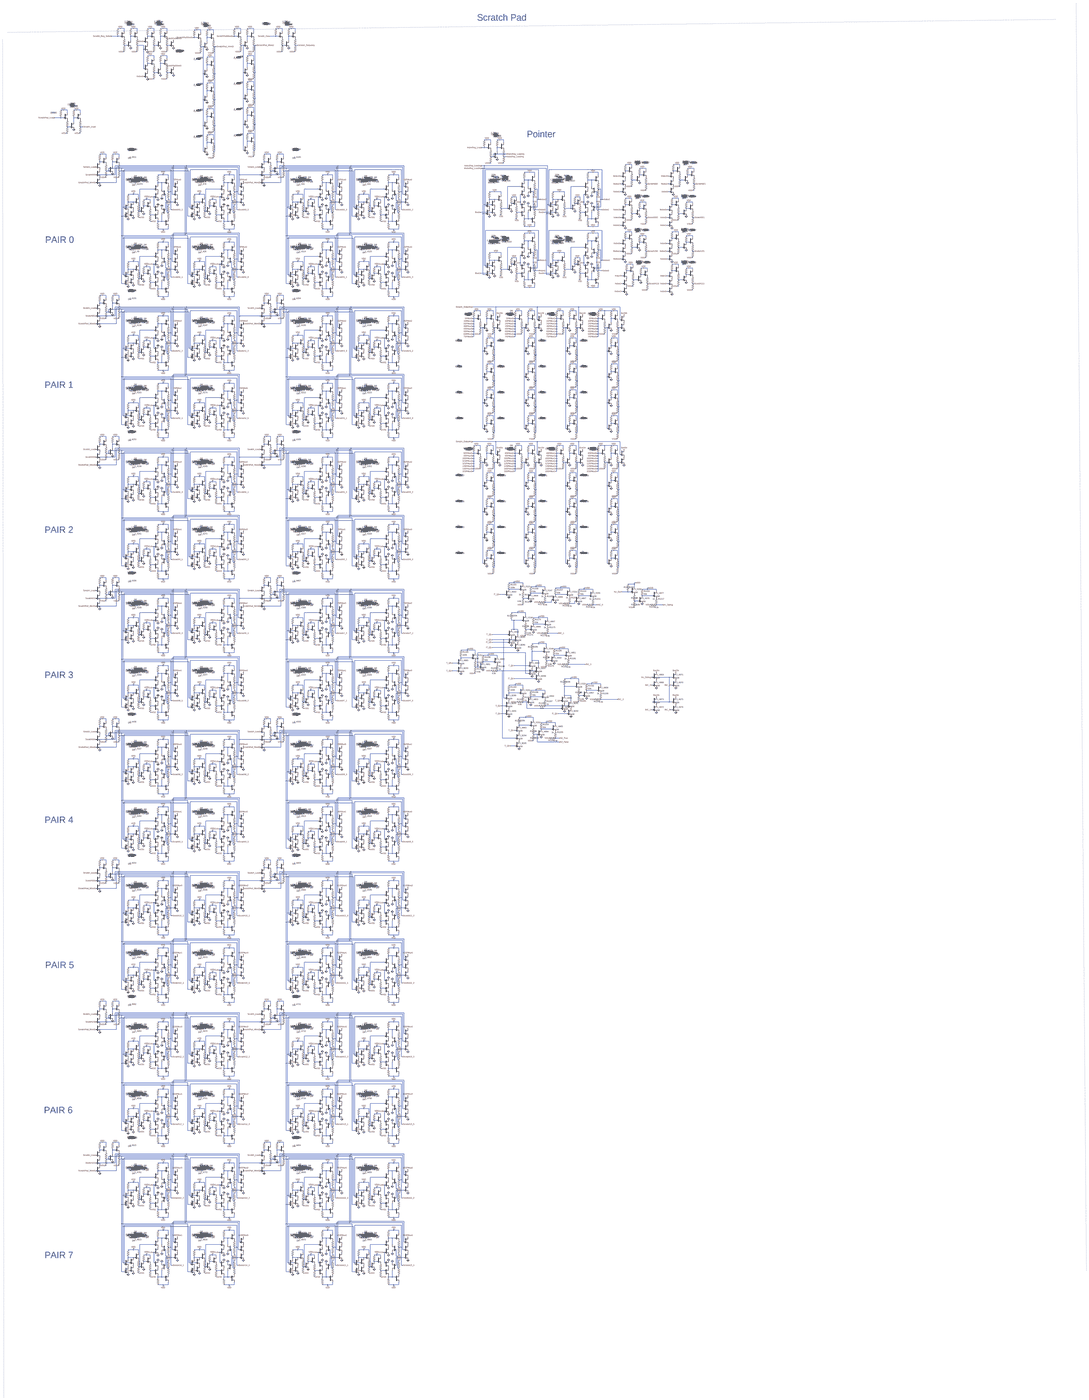
[diagram p0: schematic scratchpad.asc, whole sheet]
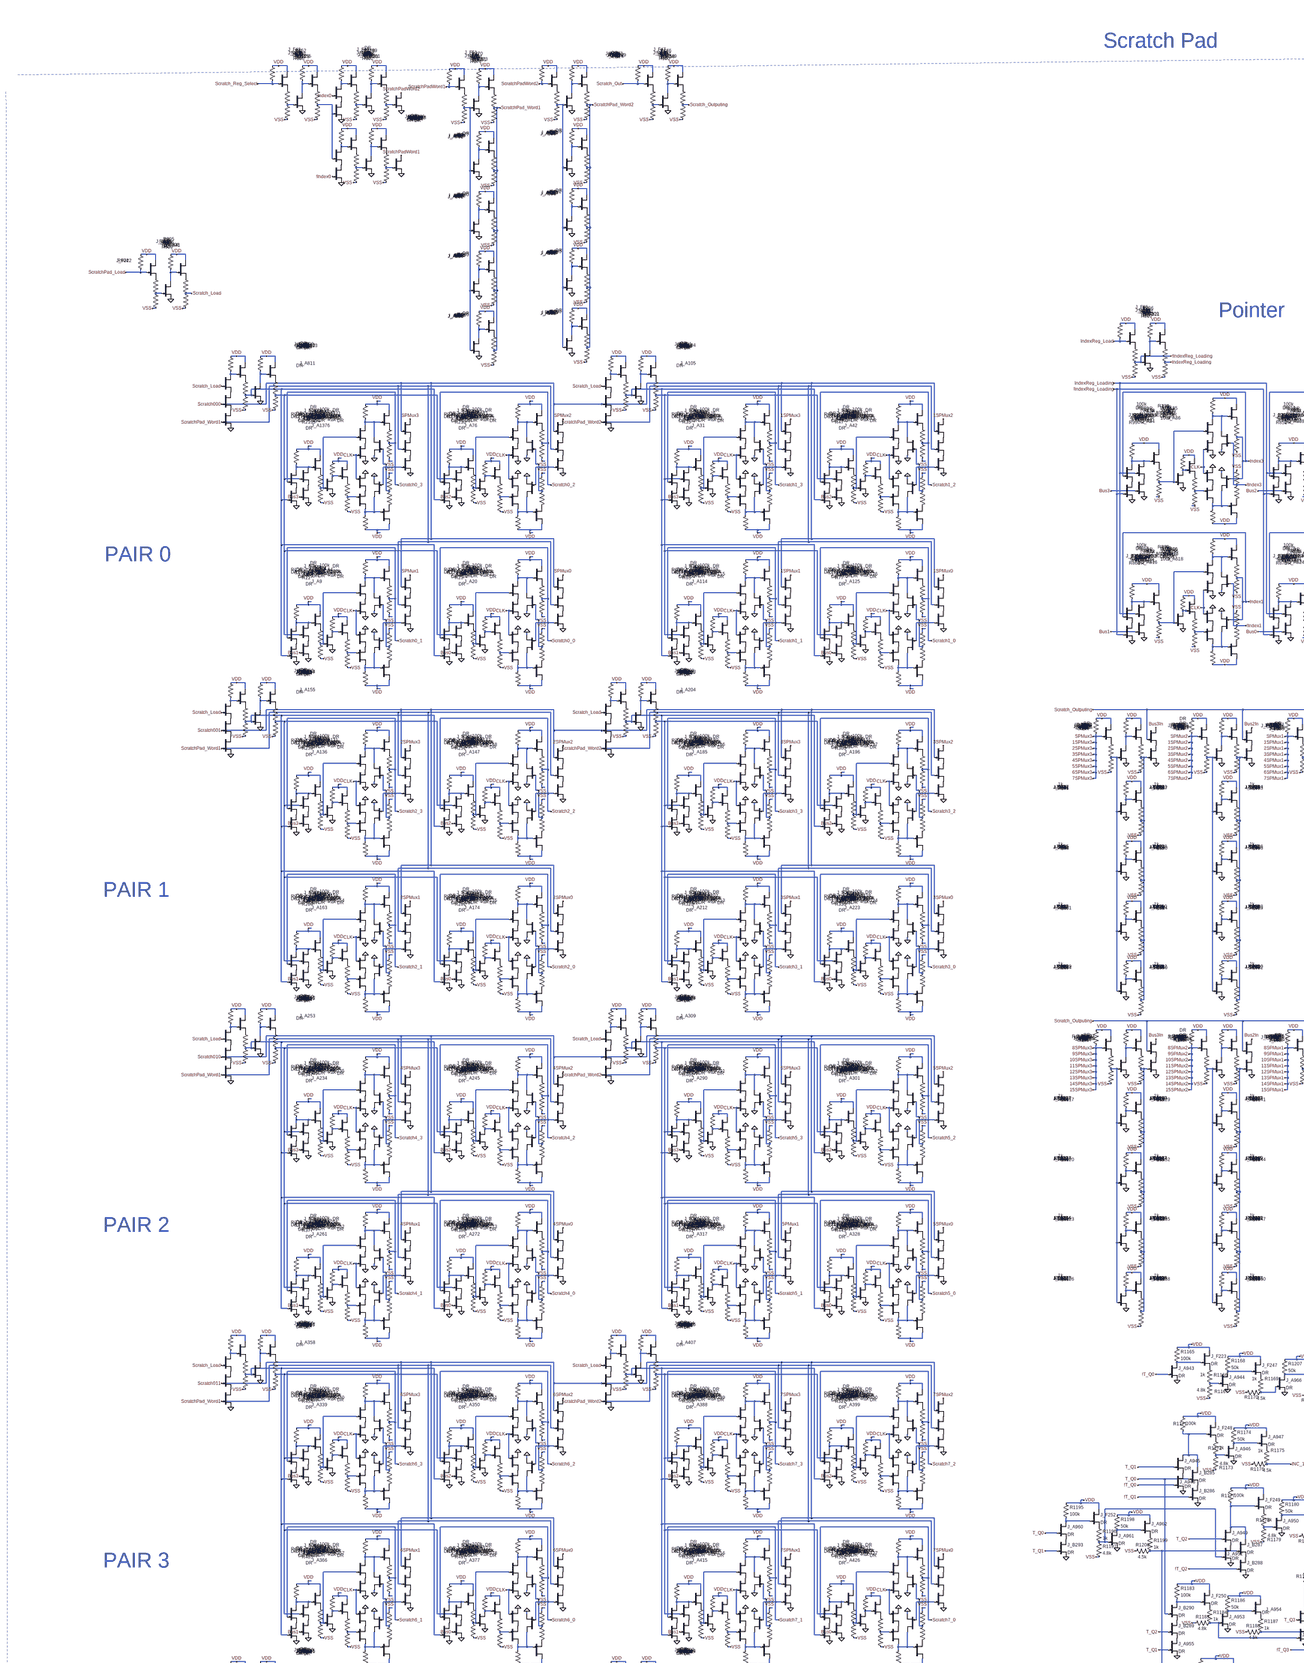
[diagram p1: schematic scratchpad.asc, part, row 1 of 2, column 1 of 2]
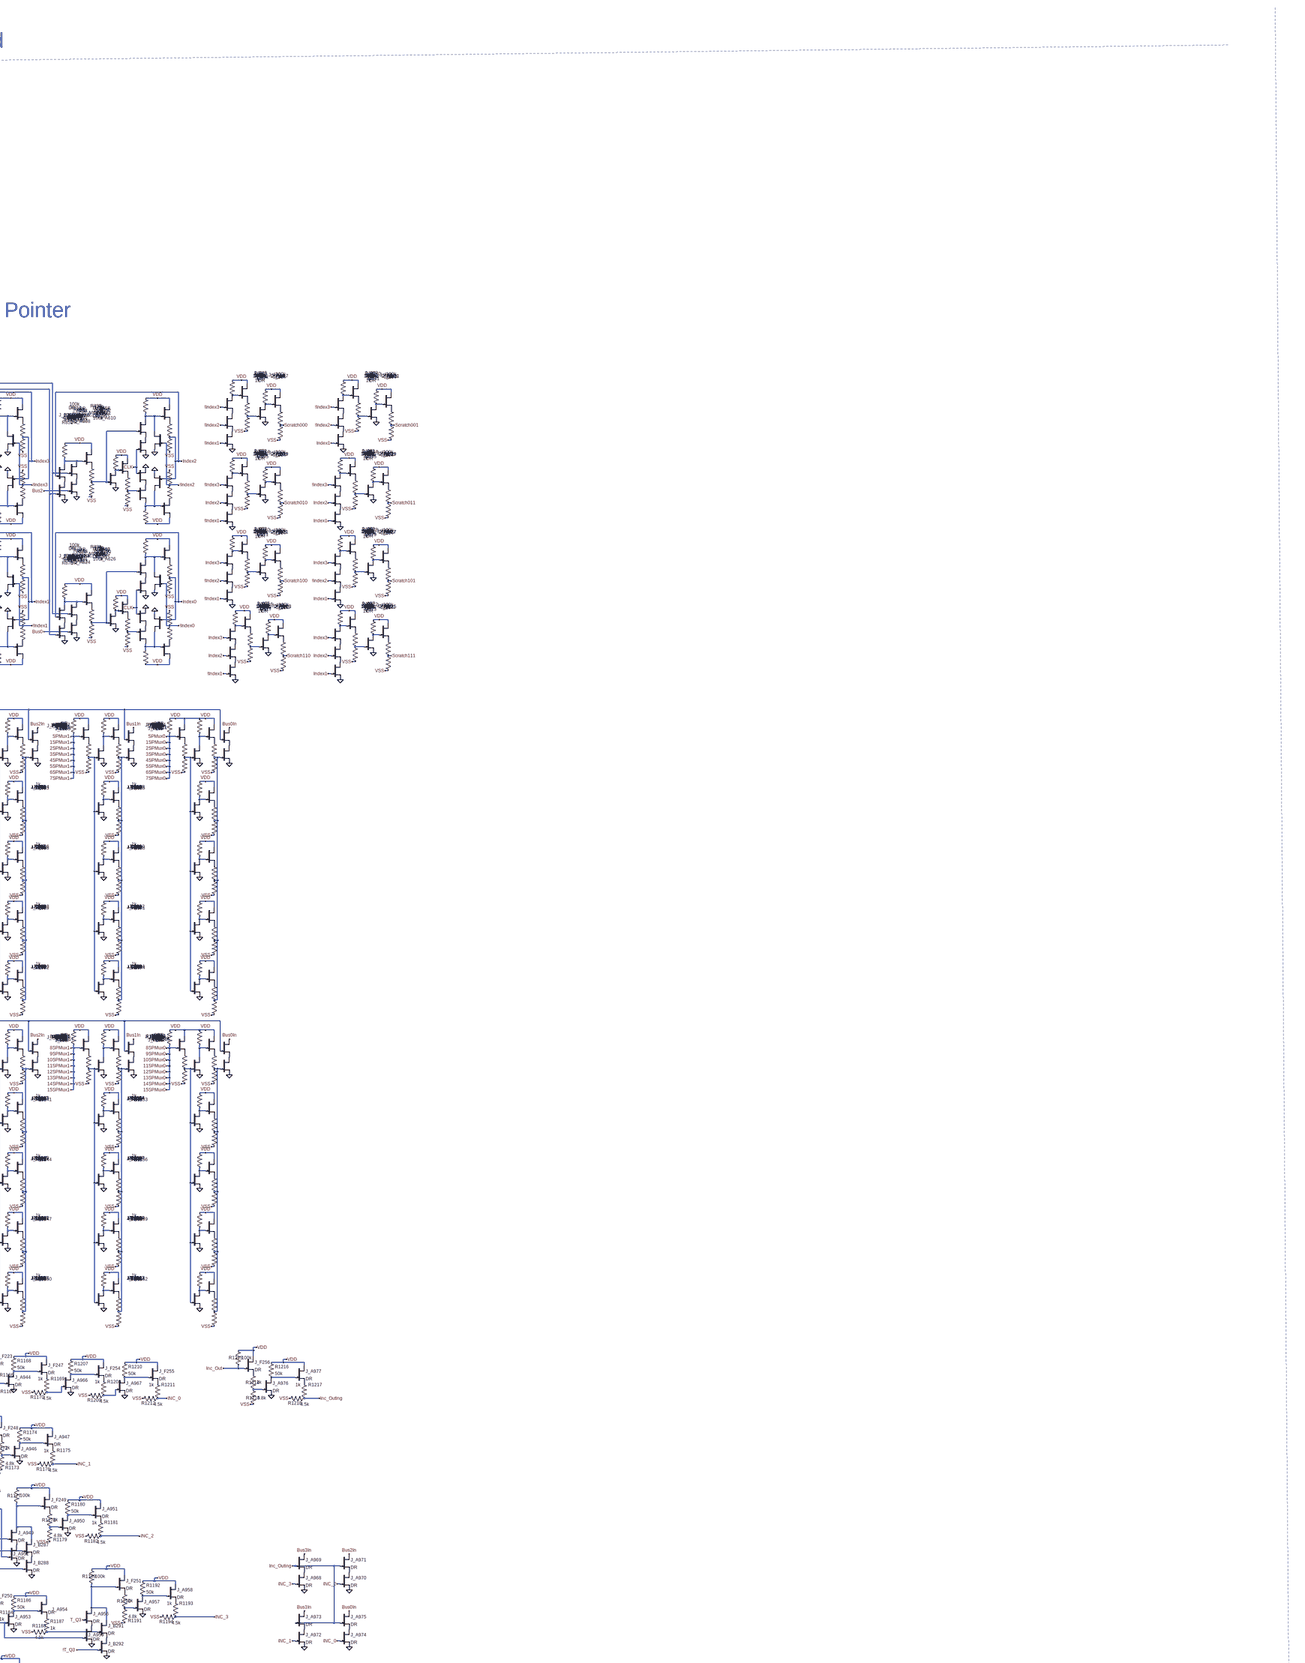
[diagram p2: schematic scratchpad.asc, part, row 1 of 2, column 2 of 2]
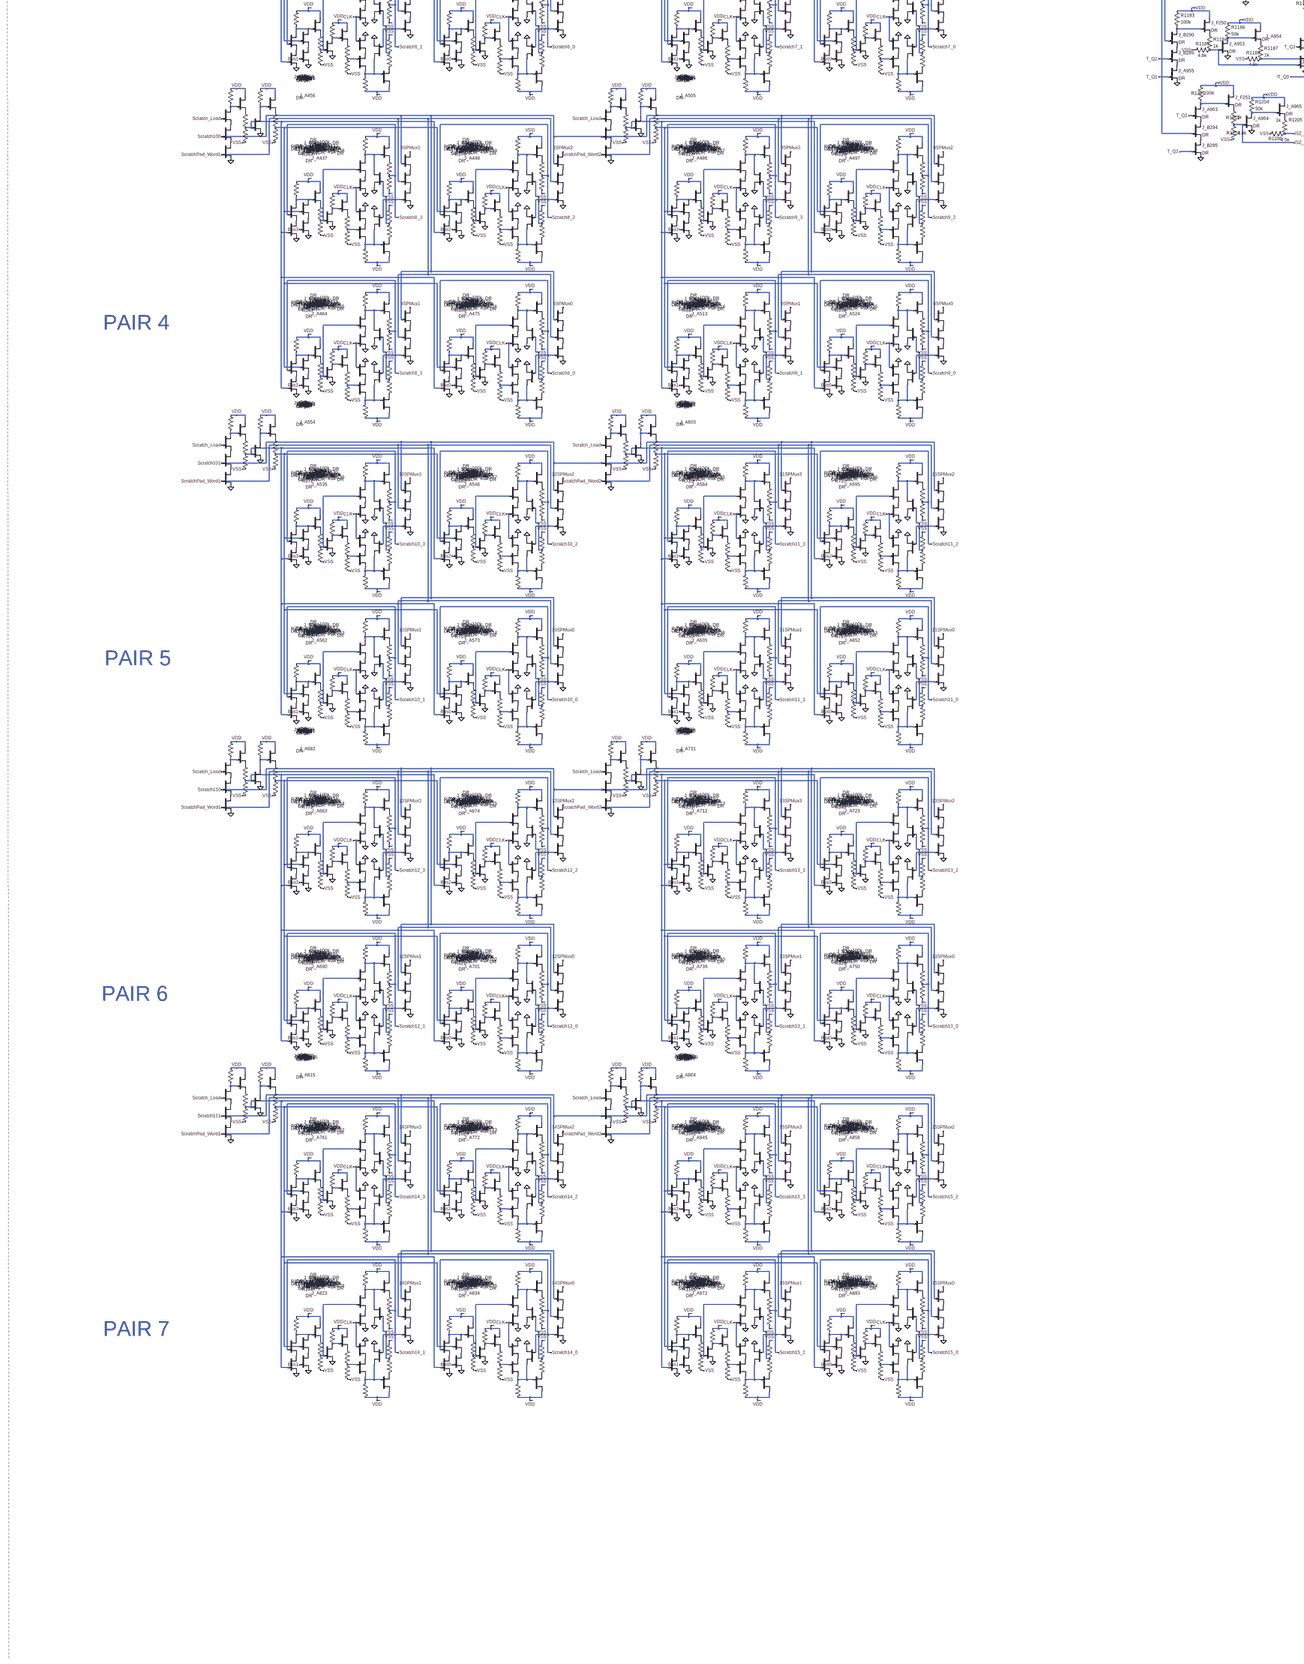
[diagram p3: schematic scratchpad.asc, part, row 2 of 2, column 1 of 2]
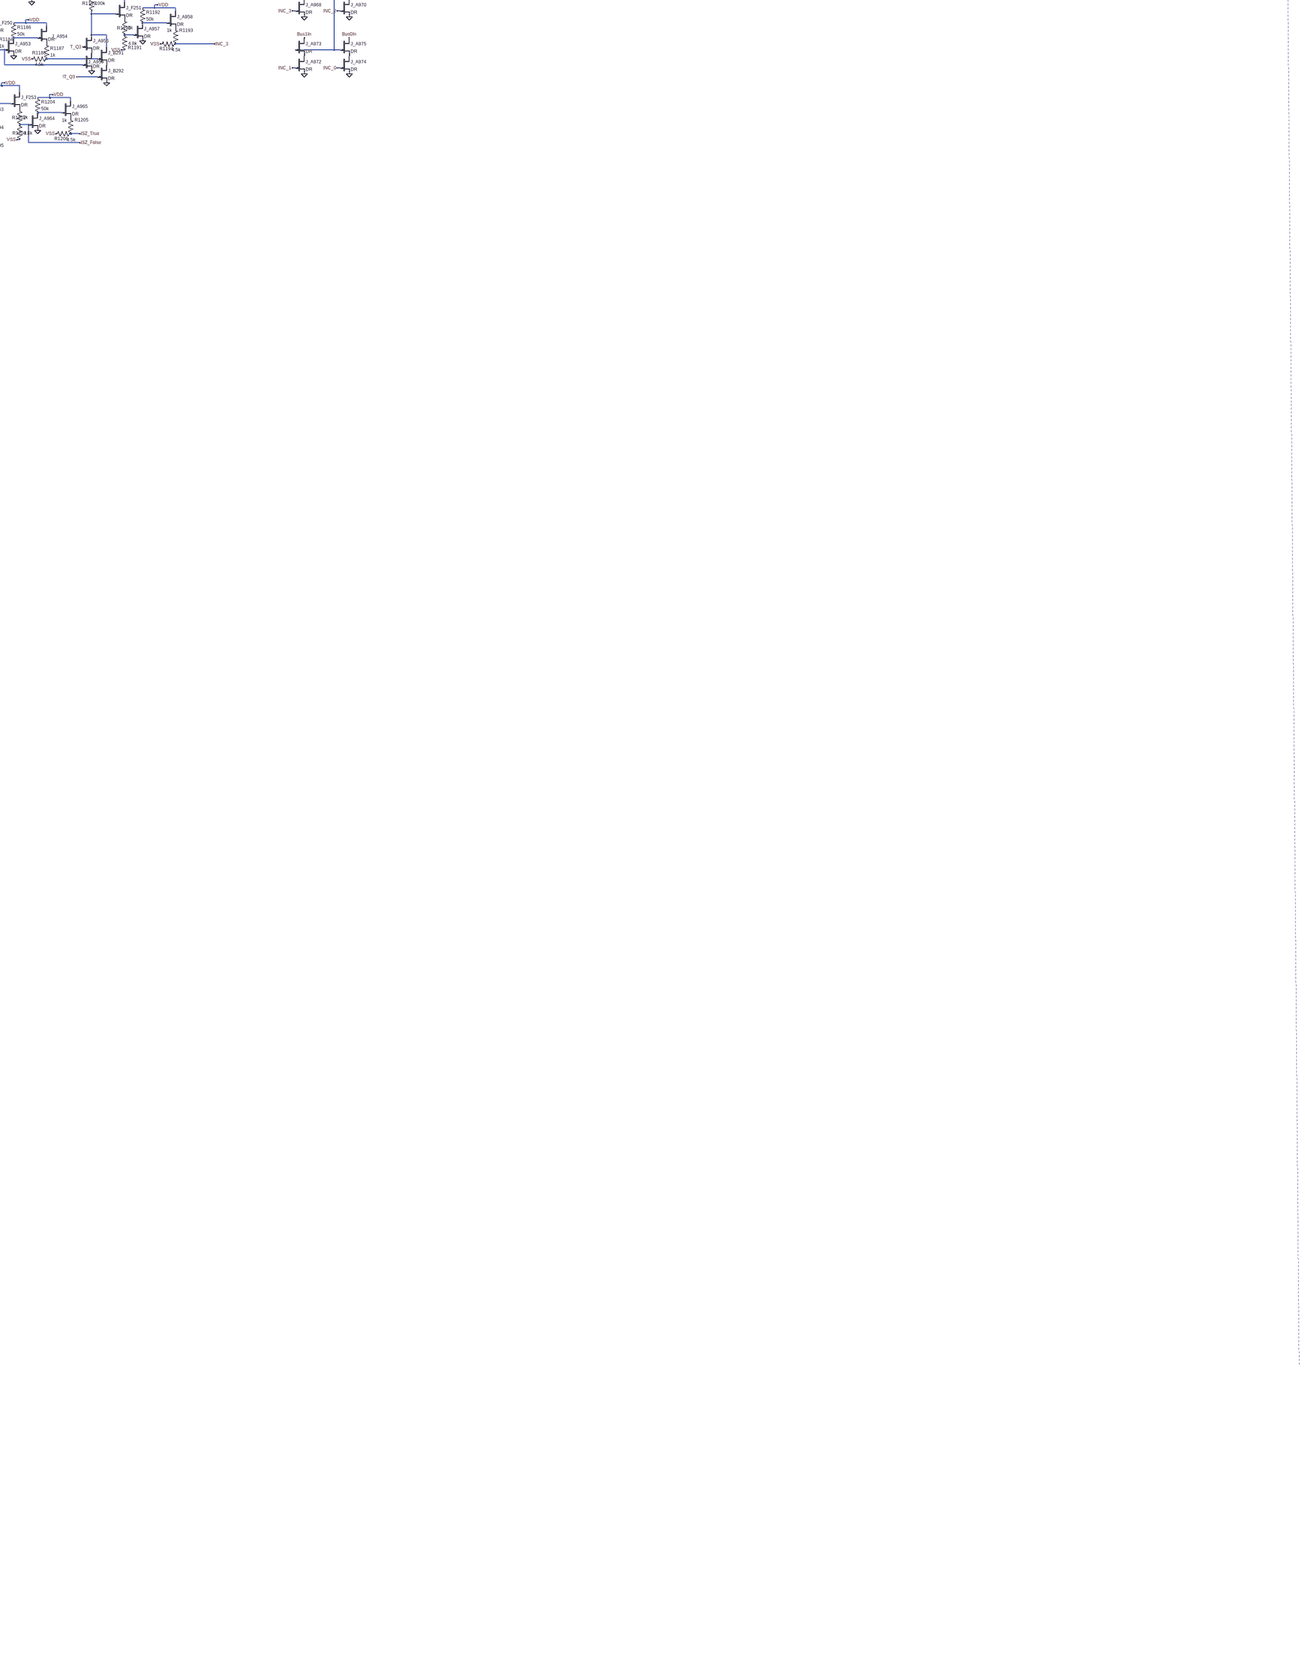
[diagram p4: schematic scratchpad.asc, part, row 2 of 2, column 2 of 2]
* scratchpad.asc
J_A1369 N045 N051 P001 DR
R2125 VDD N045 100k
J_F510 VDD N045 P002 DR
R2126 P002 Scratch0_3 1k
R2127 Scratch0_3 VSS 4.8k
J_B634 N045 N057 0 DR
J_A1370 N085 N079 P003 DR
R2128 VDD N085 100k
J_F511 VDD N085 P004 DR
R2129 P004 N057 1k
R2130 N057 VSS 4.8k
J_B635 N085 Scratch0_3 0 DR
J_A1371 P001 CLK 0 DR
J_A1372 P003 CLK 0 DR
J_A1373 N061 Scratch0_3 P005 DR
R2131 VDD N061 100k
J_F512 VDD N061 P006 DR
R2132 P006 N051 1k
R2133 N051 VSS 4.8k
J_B636 N061 N035 P007 DR
J_A1374 N069 N051 0 DR
R2134 VDD N069 50k
J_A1375 VDD N069 P008 DR
R2135 P008 N079 1k
R2136 N079 VSS 4.5k
J_A1376 P005 N033 0 DR
J_B637 P007 Bus3 0 DR
J_A64 P009 Scratch0_3 0 DR
J_A65 P010 ScratchPad_Word1 P009 DR
J_A66 7SPMux3 Scratch000 P010 DR
J_A1 N046 N052 P011 DR
R223 VDD N046 100k
J_F32 VDD N046 P012 DR
R224 P012 Scratch0_2 1k
R225 Scratch0_2 VSS 4.8k
J_B38 N046 N058 0 DR
J_A70 N086 N080 P013 DR
R226 VDD N086 100k
J_F64 VDD N086 P014 DR
R227 P014 N058 1k
R228 N058 VSS 4.8k
J_B39 N086 Scratch0_2 0 DR
J_A71 P011 CLK 0 DR
J_A72 P013 CLK 0 DR
J_A73 N062 Scratch0_2 P015 DR
R229 VDD N062 100k
J_F65 VDD N062 P016 DR
R230 P016 N052 1k
R231 N052 VSS 4.8k
J_B40 N062 N035 P017 DR
J_A74 N070 N052 0 DR
R232 VDD N070 50k
J_A75 VDD N070 P018 DR
R233 P018 N080 1k
R234 N080 VSS 4.5k
J_A76 P015 N033 0 DR
J_B41 P017 Bus2 0 DR
J_A77 P019 Scratch0_2 0 DR
J_A78 P020 ScratchPad_Word1 P019 DR
J_A286 7SPMux2 Scratch000 P020 DR
J_A48 N041 N049 P021 DR
R97 VDD N041 100k
J_F78 VDD N041 P022 DR
R98 P022 Index3 1k
R99 Index3 VSS 4.8k
J_B32 N041 !Index3 0 DR
J_A49 N083 N075 P023 DR
R100 VDD N083 100k
J_F79 VDD N083 P024 DR
R101 P024 !Index3 1k
R102 !Index3 VSS 4.8k
J_B33 N083 Index3 0 DR
J_A84 P021 CLK 0 DR
J_A85 P023 CLK 0 DR
J_A86 N055 Index3 P025 DR
R193 VDD N055 100k
J_F80 VDD N055 P026 DR
R194 P026 N049 1k
R195 N049 VSS 4.8k
J_B34 N055 IndexReg_Loading P027 DR
J_A87 N065 N049 0 DR
R196 VDD N065 50k
J_A92 VDD N065 P028 DR
R197 P028 N075 1k
R198 N075 VSS 4.5k
J_A93 P025 !IndexReg_Loading 0 DR
J_B35 P027 Bus3 0 DR
J_A606 N042 N050 P029 DR
R850 VDD N042 100k
J_F209 VDD N042 P030 DR
R851 P030 Index2 1k
R852 Index2 VSS 4.8k
J_B249 N042 !Index2 0 DR
J_A607 N084 N076 P031 DR
R853 VDD N084 100k
J_F210 VDD N084 P032 DR
R854 P032 !Index2 1k
R855 !Index2 VSS 4.8k
J_B250 N084 Index2 0 DR
J_A608 P029 CLK 0 DR
J_A609 P031 CLK 0 DR
J_A610 N056 Index2 P033 DR
R856 VDD N056 100k
J_F211 VDD N056 P034 DR
R857 P034 N050 1k
R858 N050 VSS 4.8k
J_B251 N056 IndexReg_Loading P035 DR
J_A611 N066 N050 0 DR
R859 VDD N066 50k
J_A612 VDD N066 P036 DR
R860 P036 N076 1k
R861 N076 VSS 4.5k
J_A613 P033 !IndexReg_Loading 0 DR
J_B252 P035 Bus2 0 DR
J_A614 N091 N095 P037 DR
R862 VDD N091 100k
J_F212 VDD N091 P038 DR
R863 P038 Index1 1k
R864 Index1 VSS 4.8k
J_B253 N091 !Index1 0 DR
J_A615 N129 N125 P039 DR
R865 VDD N129 100k
J_F213 VDD N129 P040 DR
R866 P040 !Index1 1k
R867 !Index1 VSS 4.8k
J_B254 N129 Index1 0 DR
J_A616 P037 CLK 0 DR
J_A617 P039 CLK 0 DR
J_A618 N107 Index1 P041 DR
R868 VDD N107 100k
J_F214 VDD N107 P042 DR
R869 P042 N095 1k
R870 N095 VSS 4.8k
J_B255 N107 IndexReg_Loading P043 DR
J_A619 N109 N095 0 DR
R871 VDD N109 50k
J_A620 VDD N109 P044 DR
R872 P044 N125 1k
R873 N125 VSS 4.5k
J_A621 P041 !IndexReg_Loading 0 DR
J_B256 P043 Bus1 0 DR
J_A622 N092 N096 P045 DR
R874 VDD N092 100k
J_F215 VDD N092 P046 DR
R875 P046 Index0 1k
R876 Index0 VSS 4.8k
J_B257 N092 !Index0 0 DR
J_A623 N130 N126 P047 DR
R877 VDD N130 100k
J_F216 VDD N130 P048 DR
R878 P048 !Index0 1k
R879 !Index0 VSS 4.8k
J_B258 N130 Index0 0 DR
J_A624 P045 CLK 0 DR
J_A625 P047 CLK 0 DR
J_A626 N108 Index0 P049 DR
R880 VDD N108 100k
J_F217 VDD N108 P050 DR
R881 P050 N096 1k
R882 N096 VSS 4.8k
J_B259 N108 IndexReg_Loading P051 DR
J_A627 N110 N096 0 DR
R883 VDD N110 50k
J_A628 VDD N110 P052 DR
R884 P052 N126 1k
R885 N126 VSS 4.5k
J_A629 P049 !IndexReg_Loading 0 DR
J_B260 P051 Bus0 0 DR
R904 VDD ScratchPad_Load 100k
J_F222 VDD ScratchPad_Load P053 DR
R905 P053 N025 1k
R906 N025 VSS 4.8k
J_A640 N024 N025 0 DR
R907 VDD N024 50k
J_A641 VDD N024 P054 DR
R908 P054 Scratch_Load 1k
R909 VSS Scratch_Load 4.5k
J_A44 N037 !Index3 P055 DR
R85 VDD N037 100k
J_F29 VDD N037 P056 DR
R86 P056 N043 1k
R87 N043 VSS 4.8k
J_B16 P055 !Index2 P057 DR
J_A45 N039 N043 0 DR
R88 VDD N039 50k
J_F30 VDD N039 P058 DR
R89 P058 Scratch000 1k
R90 VSS Scratch000 4.5k
J_B17 P057 !Index1 0 DR
J_A50 N067 !Index3 P059 DR
R103 VDD N067 100k
J_F33 VDD N067 P060 DR
R104 P060 N077 1k
R105 N077 VSS 4.8k
J_B18 P059 Index2 P061 DR
J_A51 N073 N077 0 DR
R106 VDD N073 50k
J_F34 VDD N073 P062 DR
R107 P062 Scratch010 1k
R108 VSS Scratch010 4.5k
J_B19 P061 !Index1 0 DR
J_A52 N089 Index3 P063 DR
R109 VDD N089 100k
J_F35 VDD N089 P064 DR
R110 P064 N097 1k
R111 N097 VSS 4.8k
J_B20 P063 !Index2 P065 DR
J_A53 N093 N097 0 DR
R112 VDD N093 50k
J_F36 VDD N093 P066 DR
R113 P066 Scratch100 1k
R114 VSS Scratch100 4.5k
J_B21 P065 !Index1 0 DR
J_A54 N119 Index3 P067 DR
R115 VDD N119 100k
J_F37 VDD N119 P068 DR
R116 P068 N131 1k
R117 N131 VSS 4.8k
J_B22 P067 Index2 P069 DR
J_A55 N127 N131 0 DR
R118 VDD N127 50k
J_F38 VDD N127 P070 DR
R119 P070 Scratch110 1k
R120 VSS Scratch110 4.5k
J_B23 P069 !Index1 0 DR
J_A56 N120 Index3 P071 DR
R121 VDD N120 100k
J_F39 VDD N120 P072 DR
R122 P072 N132 1k
R123 N132 VSS 4.8k
J_B24 P071 Index2 P073 DR
J_A57 N128 N132 0 DR
R124 VDD N128 50k
J_F40 VDD N128 P074 DR
R125 P074 Scratch111 1k
R126 VSS Scratch111 4.5k
J_B25 P073 Index1 0 DR
J_A58 N090 Index3 P075 DR
R127 VDD N090 100k
J_F41 VDD N090 P076 DR
R128 P076 N098 1k
R129 N098 VSS 4.8k
J_B26 P075 !Index2 P077 DR
J_A59 N094 N098 0 DR
R130 VDD N094 50k
J_F42 VDD N094 P078 DR
R131 P078 Scratch101 1k
R132 VSS Scratch101 4.5k
J_B27 P077 Index1 0 DR
J_A60 N068 !Index3 P079 DR
R133 VDD N068 100k
J_F43 VDD N068 P080 DR
R134 P080 N078 1k
R135 N078 VSS 4.8k
J_B28 P079 Index2 P081 DR
J_A61 N074 N078 0 DR
R136 VDD N074 50k
J_F44 VDD N074 P082 DR
R137 P082 Scratch011 1k
R138 VSS Scratch011 4.5k
J_B29 P081 Index1 0 DR
J_A62 N038 !Index3 P083 DR
R139 VDD N038 100k
J_F45 VDD N038 P084 DR
R140 P084 N044 1k
R141 N044 VSS 4.8k
J_B30 P083 !Index2 P085 DR
J_A63 N040 N044 0 DR
R142 VDD N040 50k
J_F46 VDD N040 P086 DR
R143 P086 Scratch001 1k
R144 VSS Scratch001 4.5k
J_B31 P085 Index1 0 DR
R145 VDD Scratch_Out 100k
J_F47 VDD Scratch_Out P087 DR
R146 P087 N012 1k
R147 N012 VSS 4.8k
J_A67 N005 N012 0 DR
R148 VDD N005 50k
J_A68 VDD N005 P088 DR
R149 P088 Scratch_Outputing 1k
R150 VSS Scratch_Outputing 4.5k
R151 VDD Scratch_Reg_Select 100k
J_F48 VDD Scratch_Reg_Select P089 DR
R152 P089 N007 1k
R153 N007 VSS 4.8k
J_A69 N001 N007 0 DR
R154 VDD N001 50k
J_A79 VDD N001 P090 DR
R155 P090 N008 1k
R156 VSS N008 4.5k
R157 VDD N002 100k
J_F49 VDD N002 P091 DR
R158 P091 N009 1k
R159 N009 VSS 4.8k
J_A82 N003 N009 0 DR
R160 VDD N003 50k
J_A83 VDD N003 P092 DR
R161 P092 N010 1k
R162 VSS N010 4.5k
J_A793 N002 Index0 P093 DR
J_A794 P093 N008 0 DR
R163 VDD N014 100k
J_F50 VDD N014 P094 DR
R164 P094 N018 1k
R165 N018 VSS 4.8k
J_A795 N015 N018 0 DR
R166 VDD N015 50k
J_A796 VDD N015 P095 DR
R167 P095 N019 1k
R168 VSS N019 4.5k
J_A797 N014 N008 P096 DR
J_A798 P096 !Index0 0 DR
J_A799 ScratchPadWord2 N010 0 DR
J_A800 ScratchPadWord1 N019 0 DR
R169 VDD ScratchPadWord1 100k
J_F51 VDD ScratchPadWord1 P097 DR
R170 P097 N013 1k
R171 N013 VSS 4.8k
J_A80 N006 N013 0 DR
R172 VDD N006 50k
J_A81 VDD N006 P098 DR
R173 P098 ScratchPad_Word1 1k
R174 VSS ScratchPad_Word1 4.5k
R175 VDD ScratchPadWord2 100k
J_F52 VDD ScratchPadWord2 P099 DR
R176 P099 N011 1k
R177 N011 VSS 4.8k
J_A96 N004 N011 0 DR
R178 VDD N004 50k
J_A97 VDD N004 P100 DR
R179 P100 ScratchPad_Word2 1k
R180 VSS ScratchPad_Word2 4.5k
R205 VDD IndexReg_Load 100k
J_F86 VDD IndexReg_Load P101 DR
R206 P101 !IndexReg_Loading 1k
R207 !IndexReg_Loading VSS 4.8k
J_A102 N028 !IndexReg_Loading 0 DR
R208 VDD N028 50k
J_A111 VDD N028 P102 DR
R209 P102 IndexReg_Loading 1k
R210 VSS IndexReg_Loading 4.5k
R200 VDD 7SPMux3 100k
J_F58 VDD 7SPMux3 P103 DR
R201 P103 N157 1k
R203 N157 VSS 4.8k
J_A100 N149 N157 0 DR
R204 VDD N149 50k
J_A101 VDD N149 P104 DR
R211 P104 N158 1k
R212 VSS N158 4.5k
J_F59 P105 N158 0 DR
R213 VDD 7SPMux2 100k
J_F60 VDD 7SPMux2 P106 DR
R214 P106 N159 1k
R215 N159 VSS 4.8k
J_A280 N150 N159 0 DR
R216 VDD N150 50k
J_A281 VDD N150 P107 DR
R217 P107 N160 1k
R218 VSS N160 4.5k
J_F61 P108 N160 0 DR
R219 VDD 5SPMux1 100k
J_F62 VDD 5SPMux1 P109 DR
R220 P109 N161 1k
R221 N161 VSS 4.8k
J_A282 N151 N161 0 DR
R222 VDD N151 50k
J_A283 VDD N151 P110 DR
R898 P110 N162 1k
R899 VSS N162 4.5k
J_F63 P111 N162 0 DR
R900 VDD 7SPMux0 100k
J_F71 VDD 7SPMux0 P112 DR
R901 P112 N163 1k
R902 N163 VSS 4.8k
J_A284 N152 N163 0 DR
R903 VDD N152 50k
J_A285 VDD N152 P113 DR
R911 P113 N164 1k
R912 VSS N164 4.5k
J_F82 P114 N164 0 DR
J_F266 Bus3In Scratch_Outputing P105 DR
J_F267 Bus2In Scratch_Outputing P108 DR
J_F268 Bus1In Scratch_Outputing P111 DR
J_F269 Bus0In Scratch_Outputing P114 DR
R199 VDD N029 100k
J_F270 VDD N029 P115 DR
R202 P115 N033 1k
R910 N033 VSS 4.8k
J_A807 N030 N033 0 DR
R913 VDD N030 50k
J_A808 VDD N030 P116 DR
R1023 P116 N035 1k
R1024 VSS N035 4.5k
J_A809 N029 Scratch_Load P117 DR
J_A810 P117 Scratch000 P118 DR
J_A811 P118 ScratchPad_Word1 0 DR
J_A2 N099 N103 P119 DR
R1 VDD N099 100k
J_F1 VDD N099 P120 DR
R2 P120 Scratch0_1 1k
R3 Scratch0_1 VSS 4.8k
J_B1 N099 N111 0 DR
J_A3 N137 N133 P121 DR
R4 VDD N137 100k
J_F2 VDD N137 P122 DR
R5 P122 N111 1k
R6 N111 VSS 4.8k
J_B2 N137 Scratch0_1 0 DR
J_A4 P119 CLK 0 DR
J_A5 P121 CLK 0 DR
J_A6 N115 Scratch0_1 P123 DR
R7 VDD N115 100k
J_F3 VDD N115 P124 DR
R8 P124 N103 1k
R9 N103 VSS 4.8k
J_B3 N115 N035 P125 DR
J_A7 N121 N103 0 DR
R10 VDD N121 50k
J_A8 VDD N121 P126 DR
R11 P126 N133 1k
R12 N133 VSS 4.5k
J_A9 P123 N033 0 DR
J_B4 P125 Bus1 0 DR
J_A10 P127 Scratch0_1 0 DR
J_A11 P128 ScratchPad_Word1 P127 DR
J_A12 5SPMux1 Scratch000 P128 DR
J_A13 N100 N104 P129 DR
R13 VDD N100 100k
J_F4 VDD N100 P130 DR
R14 P130 Scratch0_0 1k
R15 Scratch0_0 VSS 4.8k
J_B5 N100 N112 0 DR
J_A14 N138 N134 P131 DR
R16 VDD N138 100k
J_F5 VDD N138 P132 DR
R17 P132 N112 1k
R18 N112 VSS 4.8k
J_B6 N138 Scratch0_0 0 DR
J_A15 P129 CLK 0 DR
J_A16 P131 CLK 0 DR
J_A17 N116 Scratch0_0 P133 DR
R19 VDD N116 100k
J_F6 VDD N116 P134 DR
R20 P134 N104 1k
R21 N104 VSS 4.8k
J_B7 N116 N035 P135 DR
J_A18 N122 N104 0 DR
R22 VDD N122 50k
J_A19 VDD N122 P136 DR
R23 P136 N134 1k
R24 N134 VSS 4.5k
J_A20 P133 N033 0 DR
J_B8 P135 Bus0 0 DR
J_A21 P137 Scratch0_0 0 DR
J_A22 P138 ScratchPad_Word1 P137 DR
J_A23 7SPMux0 Scratch000 P138 DR
J_A24 N047 N053 P139 DR
R25 VDD N047 100k
J_F7 VDD N047 P140 DR
R26 P140 Scratch1_3 1k
R27 Scratch1_3 VSS 4.8k
J_B9 N047 N059 0 DR
J_A25 N087 N081 P141 DR
R28 VDD N087 100k
J_F8 VDD N087 P142 DR
R29 P142 N059 1k
R30 N059 VSS 4.8k
J_B10 N087 Scratch1_3 0 DR
J_A26 P139 CLK 0 DR
J_A27 P141 CLK 0 DR
J_A28 N063 Scratch1_3 P143 DR
R31 VDD N063 100k
J_F9 VDD N063 P144 DR
R32 P144 N053 1k
R33 N053 VSS 4.8k
J_B11 N063 N036 P145 DR
J_A29 N071 N053 0 DR
R34 VDD N071 50k
J_A30 VDD N071 P146 DR
R35 P146 N081 1k
R36 N081 VSS 4.5k
J_A31 P143 N034 0 DR
J_B12 P145 Bus3 0 DR
J_A32 P147 Scratch1_3 0 DR
J_A33 P148 ScratchPad_Word2 P147 DR
J_A34 7SPMux3 Scratch000 P148 DR
J_A35 N048 N054 P149 DR
R37 VDD N048 100k
J_F10 VDD N048 P150 DR
R38 P150 Scratch1_2 1k
R39 Scratch1_2 VSS 4.8k
J_B13 N048 N060 0 DR
J_A36 N088 N082 P151 DR
R40 VDD N088 100k
J_F11 VDD N088 P152 DR
R41 P152 N060 1k
R42 N060 VSS 4.8k
J_B14 N088 Scratch1_2 0 DR
J_A37 P149 CLK 0 DR
J_A38 P151 CLK 0 DR
J_A39 N064 Scratch1_2 P153 DR
R43 VDD N064 100k
J_F12 VDD N064 P154 DR
R44 P154 N054 1k
R45 N054 VSS 4.8k
J_B15 N064 N036 P155 DR
J_A40 N072 N054 0 DR
R46 VDD N072 50k
J_A41 VDD N072 P156 DR
R47 P156 N082 1k
R48 N082 VSS 4.5k
J_A42 P153 N034 0 DR
J_B36 P155 Bus2 0 DR
J_A43 P157 Scratch1_2 0 DR
J_A88 P158 ScratchPad_Word2 P157 DR
J_A89 7SPMux2 Scratch000 P158 DR
R49 VDD N031 100k
J_F13 VDD N031 P159 DR
R50 P159 N034 1k
R51 N034 VSS 4.8k
J_A90 N032 N034 0 DR
R52 VDD N032 50k
J_A91 VDD N032 P160 DR
R53 P160 N036 1k
R54 VSS N036 4.5k
J_A103 N031 Scratch_Load P161 DR
J_A104 P161 Scratch000 P162 DR
J_A105 P162 ScratchPad_Word2 0 DR
J_A106 N101 N105 P163 DR
R55 VDD N101 100k
J_F14 VDD N101 P164 DR
R56 P164 Scratch1_1 1k
R57 Scratch1_1 VSS 4.8k
J_B37 N101 N113 0 DR
J_A107 N139 N135 P165 DR
R58 VDD N139 100k
J_F15 VDD N139 P166 DR
R59 P166 N113 1k
R60 N113 VSS 4.8k
J_B42 N139 Scratch1_1 0 DR
J_A108 P163 CLK 0 DR
J_A109 P165 CLK 0 DR
J_A110 N117 Scratch1_1 P167 DR
R61 VDD N117 100k
J_F16 VDD N117 P168 DR
R62 P168 N105 1k
R63 N105 VSS 4.8k
J_B43 N117 N036 P169 DR
J_A112 N123 N105 0 DR
R64 VDD N123 50k
J_A113 VDD N123 P170 DR
R65 P170 N135 1k
R66 N135 VSS 4.5k
J_A114 P167 N034 0 DR
J_B44 P169 Bus1 0 DR
J_A115 P171 Scratch1_1 0 DR
J_A116 P172 ScratchPad_Word2 P171 DR
J_A117 5SPMux1 Scratch000 P172 DR
J_A118 N102 N106 P173 DR
R67 VDD N102 100k
J_F17 VDD N102 P174 DR
R68 P174 Scratch1_0 1k
R69 Scratch1_0 VSS 4.8k
J_B45 N102 N114 0 DR
J_A119 N140 N136 P175 DR
R70 VDD N140 100k
J_F18 VDD N140 P176 DR
R71 P176 N114 1k
R72 N114 VSS 4.8k
J_B46 N140 Scratch1_0 0 DR
J_A120 P173 CLK 0 DR
J_A121 P175 CLK 0 DR
J_A122 N118 Scratch1_0 P177 DR
R73 VDD N118 100k
J_F19 VDD N118 P178 DR
R74 P178 N106 1k
R75 N106 VSS 4.8k
J_B47 N118 N036 P179 DR
J_A123 N124 N106 0 DR
R76 VDD N124 50k
J_A124 VDD N124 P180 DR
R77 P180 N136 1k
R78 N136 VSS 4.5k
J_A125 P177 N034 0 DR
J_B48 P179 Bus0 0 DR
J_A126 P181 Scratch1_0 0 DR
J_A127 P182 ScratchPad_Word2 P181 DR
J_A128 7SPMux0 Scratch000 P182 DR
J_A129 N153 N165 P183 DR
R79 VDD N153 100k
J_F20 VDD N153 P184 DR
R80 P184 Scratch2_3 1k
R81 Scratch2_3 VSS 4.8k
J_B49 N153 N169 0 DR
J_A130 N189 N185 P185 DR
R82 VDD N189 100k
J_F21 VDD N189 P186 DR
R83 P186 N169 1k
R84 N169 VSS 4.8k
J_B50 N189 Scratch2_3 0 DR
J_A131 P183 CLK 0 DR
J_A132 P185 CLK 0 DR
J_A133 N173 Scratch2_3 P187 DR
R235 VDD N173 100k
J_F22 VDD N173 P188 DR
R236 P188 N165 1k
R237 N165 VSS 4.8k
J_B51 N173 N147 P189 DR
J_A134 N181 N165 0 DR
R238 VDD N181 50k
J_A135 VDD N181 P190 DR
R239 P190 N185 1k
R240 N185 VSS 4.5k
J_A136 P187 N145 0 DR
J_B52 P189 Bus3 0 DR
J_A137 P191 Scratch2_3 0 DR
J_A138 P192 ScratchPad_Word1 P191 DR
J_A139 7SPMux3 Scratch001 P192 DR
J_A140 N154 N166 P193 DR
R241 VDD N154 100k
J_F23 VDD N154 P194 DR
R242 P194 Scratch2_2 1k
R243 Scratch2_2 VSS 4.8k
J_B53 N154 N170 0 DR
J_A141 N190 N186 P195 DR
R244 VDD N190 100k
J_F24 VDD N190 P196 DR
R245 P196 N170 1k
R246 N170 VSS 4.8k
J_B54 N190 Scratch2_2 0 DR
J_A142 P193 CLK 0 DR
J_A143 P195 CLK 0 DR
J_A144 N174 Scratch2_2 P197 DR
R247 VDD N174 100k
J_F25 VDD N174 P198 DR
R248 P198 N166 1k
R249 N166 VSS 4.8k
J_B55 N174 N147 P199 DR
J_A145 N182 N166 0 DR
R250 VDD N182 50k
J_A146 VDD N182 P200 DR
R251 P200 N186 1k
R252 N186 VSS 4.5k
J_A147 P197 N145 0 DR
J_B56 P199 Bus2 0 DR
J_A148 P201 Scratch2_2 0 DR
J_A149 P202 ScratchPad_Word1 P201 DR
J_A150 7SPMux2 Scratch001 P202 DR
R253 VDD N141 100k
J_F26 VDD N141 P203 DR
R254 P203 N145 1k
R255 N145 VSS 4.8k
J_A151 N142 N145 0 DR
R256 VDD N142 50k
J_A152 VDD N142 P204 DR
R257 P204 N147 1k
R258 VSS N147 4.5k
J_A153 N141 Scratch_Load P205 DR
J_A154 P205 Scratch001 P206 DR
J_A155 P206 ScratchPad_Word1 0 DR
J_A156 N197 N201 P207 DR
R259 VDD N197 100k
J_F27 VDD N197 P208 DR
R260 P208 Scratch2_1 1k
R261 Scratch2_1 VSS 4.8k
J_B57 N197 N209 0 DR
J_A157 N229 N221 P209 DR
R262 VDD N229 100k
J_F28 VDD N229 P210 DR
R263 P210 N209 1k
R264 N209 VSS 4.8k
J_B58 N229 Scratch2_1 0 DR
J_A158 P207 CLK 0 DR
J_A159 P209 CLK 0 DR
J_A160 N213 Scratch2_1 P211 DR
R265 VDD N213 100k
J_F66 VDD N213 P212 DR
R266 P212 N201 1k
R267 N201 VSS 4.8k
J_B59 N213 N147 P213 DR
J_A161 N217 N201 0 DR
R268 VDD N217 50k
J_A162 VDD N217 P214 DR
R269 P214 N221 1k
R270 N221 VSS 4.5k
J_A163 P211 N145 0 DR
J_B60 P213 Bus1 0 DR
J_A164 P215 Scratch2_1 0 DR
J_A165 P216 ScratchPad_Word1 P215 DR
J_A166 5SPMux1 Scratch001 P216 DR
J_A167 N198 N202 P217 DR
R271 VDD N198 100k
J_F67 VDD N198 P218 DR
R272 P218 Scratch2_0 1k
R273 Scratch2_0 VSS 4.8k
J_B61 N198 N210 0 DR
J_A168 N230 N222 P219 DR
R274 VDD N230 100k
J_F68 VDD N230 P220 DR
R275 P220 N210 1k
R276 N210 VSS 4.8k
J_B62 N230 Scratch2_0 0 DR
J_A169 P217 CLK 0 DR
J_A170 P219 CLK 0 DR
J_A171 N214 Scratch2_0 P221 DR
R277 VDD N214 100k
J_F69 VDD N214 P222 DR
R278 P222 N202 1k
R279 N202 VSS 4.8k
J_B63 N214 N147 P223 DR
J_A172 N218 N202 0 DR
R280 VDD N218 50k
J_A173 VDD N218 P224 DR
R281 P224 N222 1k
R282 N222 VSS 4.5k
J_A174 P221 N145 0 DR
J_B64 P223 Bus0 0 DR
J_A175 P225 Scratch2_0 0 DR
J_A176 P226 ScratchPad_Word1 P225 DR
J_A177 7SPMux0 Scratch001 P226 DR
J_A178 N155 N167 P227 DR
R283 VDD N155 100k
J_F70 VDD N155 P228 DR
R284 P228 Scratch3_3 1k
R285 Scratch3_3 VSS 4.8k
J_B65 N155 N171 0 DR
J_A179 N191 N187 P229 DR
R286 VDD N191 100k
J_F72 VDD N191 P230 DR
R287 P230 N171 1k
R288 N171 VSS 4.8k
J_B66 N191 Scratch3_3 0 DR
J_A180 P227 CLK 0 DR
J_A181 P229 CLK 0 DR
J_A182 N175 Scratch3_3 P231 DR
R289 VDD N175 100k
J_F73 VDD N175 P232 DR
R290 P232 N167 1k
R291 N167 VSS 4.8k
J_B67 N175 N148 P233 DR
J_A183 N183 N167 0 DR
R292 VDD N183 50k
J_A184 VDD N183 P234 DR
R293 P234 N187 1k
R294 N187 VSS 4.5k
J_A185 P231 N146 0 DR
J_B68 P233 Bus3 0 DR
J_A186 P235 Scratch3_3 0 DR
J_A187 P236 ScratchPad_Word2 P235 DR
J_A188 7SPMux3 Scratch001 P236 DR
J_A189 N156 N168 P237 DR
R295 VDD N156 100k
J_F74 VDD N156 P238 DR
R296 P238 Scratch3_2 1k
R297 Scratch3_2 VSS 4.8k
J_B69 N156 N172 0 DR
J_A190 N192 N188 P239 DR
R298 VDD N192 100k
J_F75 VDD N192 P240 DR
R299 P240 N172 1k
R300 N172 VSS 4.8k
J_B70 N192 Scratch3_2 0 DR
J_A191 P237 CLK 0 DR
J_A192 P239 CLK 0 DR
J_A193 N176 Scratch3_2 P241 DR
R301 VDD N176 100k
J_F76 VDD N176 P242 DR
R302 P242 N168 1k
R303 N168 VSS 4.8k
J_B71 N176 N148 P243 DR
J_A194 N184 N168 0 DR
R304 VDD N184 50k
J_A195 VDD N184 P244 DR
R305 P244 N188 1k
R306 N188 VSS 4.5k
J_A196 P241 N146 0 DR
J_B72 P243 Bus2 0 DR
J_A197 P245 Scratch3_2 0 DR
J_A198 P246 ScratchPad_Word2 P245 DR
J_A199 7SPMux2 Scratch001 P246 DR
R307 VDD N143 100k
J_F77 VDD N143 P247 DR
R308 P247 N146 1k
R309 N146 VSS 4.8k
J_A200 N144 N146 0 DR
R310 VDD N144 50k
J_A201 VDD N144 P248 DR
R311 P248 N148 1k
R312 VSS N148 4.5k
J_A202 N143 Scratch_Load P249 DR
J_A203 P249 Scratch001 P250 DR
J_A204 P250 ScratchPad_Word2 0 DR
J_A205 N199 N203 P251 DR
R313 VDD N199 100k
J_F81 VDD N199 P252 DR
R314 P252 Scratch3_1 1k
R315 Scratch3_1 VSS 4.8k
J_B73 N199 N211 0 DR
J_A206 N231 N223 P253 DR
R316 VDD N231 100k
J_F85 VDD N231 P254 DR
R317 P254 N211 1k
R318 N211 VSS 4.8k
J_B74 N231 Scratch3_1 0 DR
J_A207 P251 CLK 0 DR
J_A208 P253 CLK 0 DR
J_A209 N215 Scratch3_1 P255 DR
R319 VDD N215 100k
J_F90 VDD N215 P256 DR
R320 P256 N203 1k
R321 N203 VSS 4.8k
J_B75 N215 N148 P257 DR
J_A210 N219 N203 0 DR
R322 VDD N219 50k
J_A211 VDD N219 P258 DR
R323 P258 N223 1k
R324 N223 VSS 4.5k
J_A212 P255 N146 0 DR
J_B76 P257 Bus1 0 DR
J_A213 P259 Scratch3_1 0 DR
J_A214 P260 ScratchPad_Word2 P259 DR
J_A215 5SPMux1 Scratch001 P260 DR
J_A216 N200 N204 P261 DR
R325 VDD N200 100k
J_F91 VDD N200 P262 DR
R326 P262 Scratch3_0 1k
R327 Scratch3_0 VSS 4.8k
J_B77 N200 N212 0 DR
J_A217 N232 N224 P263 DR
R328 VDD N232 100k
J_F92 VDD N232 P264 DR
R329 P264 N212 1k
R330 N212 VSS 4.8k
J_B78 N232 Scratch3_0 0 DR
J_A218 P261 CLK 0 DR
J_A219 P263 CLK 0 DR
J_A220 N216 Scratch3_0 P265 DR
R331 VDD N216 100k
J_F93 VDD N216 P266 DR
R332 P266 N204 1k
R333 N204 VSS 4.8k
J_B79 N216 N148 P267 DR
J_A221 N220 N204 0 DR
R334 VDD N220 50k
J_A222 VDD N220 P268 DR
R335 P268 N224 1k
R336 N224 VSS 4.5k
J_A223 P265 N146 0 DR
J_B80 P267 Bus0 0 DR
J_A224 P269 Scratch3_0 0 DR
J_A225 P270 ScratchPad_Word2 P269 DR
J_A226 7SPMux0 Scratch001 P270 DR
J_A227 N253 N257 P271 DR
R337 VDD N253 100k
J_F94 VDD N253 P272 DR
R338 P272 Scratch4_3 1k
R339 Scratch4_3 VSS 4.8k
J_B81 N253 N265 0 DR
J_A228 N281 N277 P273 DR
R340 VDD N281 100k
J_F95 VDD N281 P274 DR
R341 P274 N265 1k
R342 N265 VSS 4.8k
J_B82 N281 Scratch4_3 0 DR
J_A229 P271 CLK 0 DR
J_A230 P273 CLK 0 DR
J_A231 N269 Scratch4_3 P275 DR
R343 VDD N269 100k
J_F96 VDD N269 P276 DR
R344 P276 N257 1k
R345 N257 VSS 4.8k
J_B83 N269 N239 P277 DR
J_A232 N273 N257 0 DR
R346 VDD N273 50k
J_A233 VDD N273 P278 DR
R347 P278 N277 1k
R348 N277 VSS 4.5k
J_A234 P275 N237 0 DR
J_B84 P277 Bus3 0 DR
J_A235 P279 Scratch4_3 0 DR
J_A236 P280 ScratchPad_Word1 P279 DR
J_A237 7SPMux3 Scratch010 P280 DR
J_A238 N254 N258 P281 DR
R349 VDD N254 100k
J_F97 VDD N254 P282 DR
R350 P282 Scratch4_2 1k
R351 Scratch4_2 VSS 4.8k
J_B85 N254 N266 0 DR
J_A239 N282 N278 P283 DR
R352 VDD N282 100k
J_F98 VDD N282 P284 DR
R353 P284 N266 1k
R354 N266 VSS 4.8k
J_B86 N282 Scratch4_2 0 DR
J_A240 P281 CLK 0 DR
J_A241 P283 CLK 0 DR
J_A242 N270 Scratch4_2 P285 DR
R355 VDD N270 100k
J_F99 VDD N270 P286 DR
R356 P286 N258 1k
R357 N258 VSS 4.8k
J_B87 N270 N239 P287 DR
J_A243 N274 N258 0 DR
R358 VDD N274 50k
J_A244 VDD N274 P288 DR
R359 P288 N278 1k
R360 N278 VSS 4.5k
J_A245 P285 N237 0 DR
J_B88 P287 Bus2 0 DR
J_A246 P289 Scratch4_2 0 DR
J_A247 P290 ScratchPad_Word1 P289 DR
J_A248 7SPMux2 Scratch010 P290 DR
R361 VDD N233 100k
J_F100 VDD N233 P291 DR
R362 P291 N237 1k
R363 N237 VSS 4.8k
J_A249 N234 N237 0 DR
R364 VDD N234 50k
J_A250 VDD N234 P292 DR
R365 P292 N239 1k
R366 VSS N239 4.5k
J_A251 N233 Scratch_Load P293 DR
J_A252 P293 Scratch010 P294 DR
J_A253 P294 ScratchPad_Word1 0 DR
J_A254 N289 N297 P295 DR
R367 VDD N289 100k
J_F101 VDD N289 P296 DR
R368 P296 Scratch4_1 1k
R369 Scratch4_1 VSS 4.8k
J_B89 N289 N301 0 DR
J_A255 N321 N317 P297 DR
R370 VDD N321 100k
J_F102 VDD N321 P298 DR
R371 P298 N301 1k
R372 N301 VSS 4.8k
J_B90 N321 Scratch4_1 0 DR
J_A256 P295 CLK 0 DR
J_A257 P297 CLK 0 DR
J_A258 N305 Scratch4_1 P299 DR
R373 VDD N305 100k
J_F103 VDD N305 P300 DR
R374 P300 N297 1k
R375 N297 VSS 4.8k
J_B91 N305 N239 P301 DR
J_A259 N309 N297 0 DR
R376 VDD N309 50k
J_A260 VDD N309 P302 DR
R377 P302 N317 1k
R378 N317 VSS 4.5k
J_A261 P299 N237 0 DR
J_B92 P301 Bus1 0 DR
J_A262 P303 Scratch4_1 0 DR
J_A263 P304 ScratchPad_Word1 P303 DR
J_A264 5SPMux1 Scratch010 P304 DR
J_A265 N290 N298 P305 DR
R379 VDD N290 100k
J_F104 VDD N290 P306 DR
R380 P306 Scratch4_0 1k
R381 Scratch4_0 VSS 4.8k
J_B93 N290 N302 0 DR
J_A266 N322 N318 P307 DR
R382 VDD N322 100k
J_F105 VDD N322 P308 DR
R383 P308 N302 1k
R384 N302 VSS 4.8k
J_B94 N322 Scratch4_0 0 DR
J_A267 P305 CLK 0 DR
J_A268 P307 CLK 0 DR
J_A269 N306 Scratch4_0 P309 DR
R385 VDD N306 100k
J_F106 VDD N306 P310 DR
R386 P310 N298 1k
R387 N298 VSS 4.8k
J_B95 N306 N239 P311 DR
J_A270 N310 N298 0 DR
R388 VDD N310 50k
J_A271 VDD N310 P312 DR
R389 P312 N318 1k
R390 N318 VSS 4.5k
J_A272 P309 N237 0 DR
J_B96 P311 Bus0 0 DR
J_A273 P313 Scratch4_0 0 DR
J_A274 P314 ScratchPad_Word1 P313 DR
J_A275 7SPMux0 Scratch010 P314 DR
J_A276 N255 N259 P315 DR
R391 VDD N255 100k
J_F107 VDD N255 P316 DR
R392 P316 Scratch5_3 1k
R393 Scratch5_3 VSS 4.8k
J_B97 N255 N267 0 DR
J_A277 N283 N279 P317 DR
R394 VDD N283 100k
J_F108 VDD N283 P318 DR
R395 P318 N267 1k
R396 N267 VSS 4.8k
J_B98 N283 Scratch5_3 0 DR
J_A278 P315 CLK 0 DR
J_A279 P317 CLK 0 DR
J_A287 N271 Scratch5_3 P319 DR
R397 VDD N271 100k
J_F109 VDD N271 P320 DR
R398 P320 N259 1k
R399 N259 VSS 4.8k
J_B99 N271 N240 P321 DR
J_A288 N275 N259 0 DR
R400 VDD N275 50k
J_A289 VDD N275 P322 DR
R401 P322 N279 1k
R402 N279 VSS 4.5k
J_A290 P319 N238 0 DR
J_B100 P321 Bus3 0 DR
J_A291 P323 Scratch5_3 0 DR
J_A292 P324 ScratchPad_Word2 P323 DR
J_A293 7SPMux3 Scratch010 P324 DR
J_A294 N256 N260 P325 DR
R403 VDD N256 100k
J_F110 VDD N256 P326 DR
R404 P326 Scratch5_2 1k
R405 Scratch5_2 VSS 4.8k
J_B101 N256 N268 0 DR
J_A295 N284 N280 P327 DR
R406 VDD N284 100k
J_F111 VDD N284 P328 DR
R407 P328 N268 1k
R408 N268 VSS 4.8k
J_B102 N284 Scratch5_2 0 DR
J_A296 P325 CLK 0 DR
J_A297 P327 CLK 0 DR
J_A298 N272 Scratch5_2 P329 DR
R409 VDD N272 100k
J_F112 VDD N272 P330 DR
R410 P330 N260 1k
R411 N260 VSS 4.8k
J_B103 N272 N240 P331 DR
J_A299 N276 N260 0 DR
R412 VDD N276 50k
J_A300 VDD N276 P332 DR
R413 P332 N280 1k
R414 N280 VSS 4.5k
J_A301 P329 N238 0 DR
J_B104 P331 Bus2 0 DR
J_A302 P333 Scratch5_2 0 DR
J_A303 P334 ScratchPad_Word2 P333 DR
J_A304 7SPMux2 Scratch010 P334 DR
R415 VDD N235 100k
J_F113 VDD N235 P335 DR
R416 P335 N238 1k
R417 N238 VSS 4.8k
J_A305 N236 N238 0 DR
R418 VDD N236 50k
J_A306 VDD N236 P336 DR
R419 P336 N240 1k
R420 VSS N240 4.5k
J_A307 N235 Scratch_Load P337 DR
J_A308 P337 Scratch010 P338 DR
J_A309 P338 ScratchPad_Word2 0 DR
J_A310 N291 N299 P339 DR
R421 VDD N291 100k
J_F114 VDD N291 P340 DR
R422 P340 Scratch5_1 1k
R423 Scratch5_1 VSS 4.8k
J_B105 N291 N303 0 DR
J_A311 N323 N319 P341 DR
R424 VDD N323 100k
J_F115 VDD N323 P342 DR
R425 P342 N303 1k
R426 N303 VSS 4.8k
J_B106 N323 Scratch5_1 0 DR
J_A312 P339 CLK 0 DR
J_A313 P341 CLK 0 DR
J_A314 N307 Scratch5_1 P343 DR
R427 VDD N307 100k
J_F116 VDD N307 P344 DR
R428 P344 N299 1k
R429 N299 VSS 4.8k
J_B107 N307 N240 P345 DR
J_A315 N311 N299 0 DR
R430 VDD N311 50k
J_A316 VDD N311 P346 DR
R431 P346 N319 1k
R432 N319 VSS 4.5k
J_A317 P343 N238 0 DR
J_B108 P345 Bus1 0 DR
J_A318 P347 Scratch5_1 0 DR
J_A319 P348 ScratchPad_Word2 P347 DR
J_A320 5PMux1 Scratch010 P348 DR
J_A321 N292 N300 P349 DR
R433 VDD N292 100k
J_F117 VDD N292 P350 DR
R434 P350 Scratch5_0 1k
R435 Scratch5_0 VSS 4.8k
J_B109 N292 N304 0 DR
J_A322 N324 N320 P351 DR
R436 VDD N324 100k
J_F118 VDD N324 P352 DR
R437 P352 N304 1k
R438 N304 VSS 4.8k
J_B110 N324 Scratch5_0 0 DR
J_A323 P349 CLK 0 DR
J_A324 P351 CLK 0 DR
J_A325 N308 Scratch5_0 P353 DR
R439 VDD N308 100k
J_F119 VDD N308 P354 DR
R440 P354 N300 1k
R441 N300 VSS 4.8k
J_B111 N308 N240 P355 DR
J_A326 N312 N300 0 DR
R442 VDD N312 50k
J_A327 VDD N312 P356 DR
R443 P356 N320 1k
R444 N320 VSS 4.5k
J_A328 P353 N238 0 DR
J_B112 P355 Bus0 0 DR
J_A329 P357 Scratch5_0 0 DR
J_A330 P358 ScratchPad_Word2 P357 DR
J_A331 7SPMux0 Scratch010 P358 DR
J_A332 N342 N346 P359 DR
R445 VDD N342 100k
J_F120 VDD N342 P360 DR
R446 P360 Scratch6_3 1k
R447 Scratch6_3 VSS 4.8k
J_B113 N342 N351 0 DR
J_A333 N369 N365 P361 DR
R448 VDD N369 100k
J_F121 VDD N369 P362 DR
R449 P362 N351 1k
R450 N351 VSS 4.8k
J_B114 N369 Scratch6_3 0 DR
J_A334 P359 CLK 0 DR
J_A335 P361 CLK 0 DR
J_A336 N356 Scratch6_3 P363 DR
R451 VDD N356 100k
J_F122 VDD N356 P364 DR
R452 P364 N346 1k
R453 N346 VSS 4.8k
J_B115 N356 N333 P365 DR
J_A337 N360 N346 0 DR
R454 VDD N360 50k
J_A338 VDD N360 P366 DR
R455 P366 N365 1k
R456 N365 VSS 4.5k
J_A339 P363 N330 0 DR
J_B116 P365 Bus3 0 DR
J_A340 P367 Scratch6_3 0 DR
J_A341 P368 ScratchPad_Word1 P367 DR
J_A342 7SPMux3 Scratch011 P368 DR
J_A343 N343 N347 P369 DR
R457 VDD N343 100k
J_F123 VDD N343 P370 DR
R458 P370 Scratch6_2 1k
R459 Scratch6_2 VSS 4.8k
J_B117 N343 N352 0 DR
J_A344 N370 N366 P371 DR
R460 VDD N370 100k
J_F124 VDD N370 P372 DR
R461 P372 N352 1k
R462 N352 VSS 4.8k
J_B118 N370 Scratch6_2 0 DR
J_A345 P369 CLK 0 DR
J_A346 P371 CLK 0 DR
J_A347 N357 Scratch6_2 P373 DR
R463 VDD N357 100k
J_F125 VDD N357 P374 DR
R464 P374 N347 1k
R465 N347 VSS 4.8k
J_B119 N357 N333 P375 DR
J_A348 N361 N347 0 DR
R466 VDD N361 50k
J_A349 VDD N361 P376 DR
R467 P376 N366 1k
R468 N366 VSS 4.5k
J_A350 P373 N330 0 DR
J_B120 P375 Bus2 0 DR
J_A351 P377 Scratch6_2 0 DR
J_A352 P378 ScratchPad_Word1 P377 DR
J_A353 7SPMux2 Scratch011 P378 DR
R469 VDD N325 100k
J_F126 VDD N325 P379 DR
R470 P379 N330 1k
R471 N330 VSS 4.8k
J_A354 N326 N330 0 DR
R472 VDD N326 50k
J_A355 VDD N326 P380 DR
R473 P380 N333 1k
R474 VSS N333 4.5k
J_A356 N325 Scratch_Load P381 DR
J_A357 P381 Scratch011 P382 DR
J_A358 P382 ScratchPad_Word1 0 DR
J_A359 N380 N384 P383 DR
R475 VDD N380 100k
J_F127 VDD N380 P384 DR
R476 P384 Scratch6_1 1k
R477 Scratch6_1 VSS 4.8k
J_B121 N380 N390 0 DR
J_A360 N411 N406 P385 DR
R478 VDD N411 100k
J_F128 VDD N411 P386 DR
R479 P386 N390 1k
R480 N390 VSS 4.8k
J_B122 N411 Scratch6_1 0 DR
J_A361 P383 CLK 0 DR
J_A362 P385 CLK 0 DR
J_A363 N394 Scratch6_1 P387 DR
R481 VDD N394 100k
J_F129 VDD N394 P388 DR
R482 P388 N384 1k
R483 N384 VSS 4.8k
J_B123 N394 N333 P389 DR
J_A364 N400 N384 0 DR
R484 VDD N400 50k
J_A365 VDD N400 P390 DR
R485 P390 N406 1k
R486 N406 VSS 4.5k
J_A366 P387 N330 0 DR
J_B124 P389 Bus1 0 DR
J_A367 P391 Scratch6_1 0 DR
J_A368 P392 ScratchPad_Word1 P391 DR
J_A369 5SPMux1 Scratch011 P392 DR
J_A370 N381 N385 P393 DR
R487 VDD N381 100k
J_F130 VDD N381 P394 DR
R488 P394 Scratch6_0 1k
R489 Scratch6_0 VSS 4.8k
J_B125 N381 N391 0 DR
J_A371 N412 N407 P395 DR
R490 VDD N412 100k
J_F131 VDD N412 P396 DR
R491 P396 N391 1k
R492 N391 VSS 4.8k
J_B126 N412 Scratch6_0 0 DR
J_A372 P393 CLK 0 DR
J_A373 P395 CLK 0 DR
J_A374 N395 Scratch6_0 P397 DR
R493 VDD N395 100k
J_F132 VDD N395 P398 DR
R494 P398 N385 1k
R495 N385 VSS 4.8k
J_B127 N395 N333 P399 DR
J_A375 N401 N385 0 DR
R496 VDD N401 50k
J_A376 VDD N401 P400 DR
R497 P400 N407 1k
R498 N407 VSS 4.5k
J_A377 P397 N330 0 DR
J_B128 P399 Bus0 0 DR
J_A378 P401 Scratch6_0 0 DR
J_A379 P402 ScratchPad_Word1 P401 DR
J_A380 7SPMux0 Scratch011 P402 DR
J_A381 N344 N348 P403 DR
R499 VDD N344 100k
J_F133 VDD N344 P404 DR
R500 P404 Scratch7_3 1k
R501 Scratch7_3 VSS 4.8k
J_B129 N344 N353 0 DR
J_A382 N371 N367 P405 DR
R502 VDD N371 100k
J_F134 VDD N371 P406 DR
R503 P406 N353 1k
R504 N353 VSS 4.8k
J_B130 N371 Scratch7_3 0 DR
J_A383 P403 CLK 0 DR
J_A384 P405 CLK 0 DR
J_A385 N358 Scratch7_3 P407 DR
R505 VDD N358 100k
J_F135 VDD N358 P408 DR
R506 P408 N348 1k
R507 N348 VSS 4.8k
J_B131 N358 N334 P409 DR
J_A386 N362 N348 0 DR
R508 VDD N362 50k
J_A387 VDD N362 P410 DR
R509 P410 N367 1k
R510 N367 VSS 4.5k
J_A388 P407 N331 0 DR
J_B132 P409 Bus3 0 DR
J_A389 P411 Scratch7_3 0 DR
J_A390 P412 ScratchPad_Word2 P411 DR
J_A391 7SPMux3 Scratch011 P412 DR
J_A392 N345 N349 P413 DR
R511 VDD N345 100k
J_F136 VDD N345 P414 DR
R512 P414 Scratch7_2 1k
R513 Scratch7_2 VSS 4.8k
J_B133 N345 N354 0 DR
J_A393 N372 N368 P415 DR
R514 VDD N372 100k
J_F137 VDD N372 P416 DR
R515 P416 N354 1k
R516 N354 VSS 4.8k
J_B134 N372 Scratch7_2 0 DR
J_A394 P413 CLK 0 DR
J_A395 P415 CLK 0 DR
J_A396 N359 Scratch7_2 P417 DR
R517 VDD N359 100k
J_F138 VDD N359 P418 DR
R518 P418 N349 1k
R519 N349 VSS 4.8k
J_B135 N359 N334 P419 DR
J_A397 N363 N349 0 DR
R520 VDD N363 50k
J_A398 VDD N363 P420 DR
R521 P420 N368 1k
R522 N368 VSS 4.5k
J_A399 P417 N331 0 DR
J_B136 P419 Bus2 0 DR
J_A400 P421 Scratch7_2 0 DR
J_A401 P422 ScratchPad_Word2 P421 DR
J_A402 7SPMux2 Scratch011 P422 DR
R523 VDD N327 100k
J_F139 VDD N327 P423 DR
R524 P423 N331 1k
R525 N331 VSS 4.8k
J_A403 N328 N331 0 DR
R526 VDD N328 50k
J_A404 VDD N328 P424 DR
R527 P424 N334 1k
R528 VSS N334 4.5k
J_A405 N327 Scratch_Load P425 DR
J_A406 P425 Scratch011 P426 DR
J_A407 P426 ScratchPad_Word2 0 DR
J_A408 N382 N386 P427 DR
R529 VDD N382 100k
J_F140 VDD N382 P428 DR
R530 P428 Scratch7_1 1k
R531 Scratch7_1 VSS 4.8k
J_B137 N382 N392 0 DR
J_A409 N413 N408 P429 DR
R532 VDD N413 100k
J_F141 VDD N413 P430 DR
R533 P430 N392 1k
R534 N392 VSS 4.8k
J_B138 N413 Scratch7_1 0 DR
J_A410 P427 CLK 0 DR
J_A411 P429 CLK 0 DR
J_A412 N396 Scratch7_1 P431 DR
R535 VDD N396 100k
J_F142 VDD N396 P432 DR
R536 P432 N386 1k
R537 N386 VSS 4.8k
J_B139 N396 N334 P433 DR
J_A413 N402 N386 0 DR
R538 VDD N402 50k
J_A414 VDD N402 P434 DR
R539 P434 N408 1k
R540 N408 VSS 4.5k
J_A415 P431 N331 0 DR
J_B140 P433 Bus1 0 DR
J_A416 P435 Scratch7_1 0 DR
J_A417 P436 ScratchPad_Word2 P435 DR
J_A418 5SPMux1 Scratch011 P436 DR
J_A419 N383 N387 P437 DR
R541 VDD N383 100k
J_F143 VDD N383 P438 DR
R542 P438 Scratch7_0 1k
R543 Scratch7_0 VSS 4.8k
J_B141 N383 N393 0 DR
J_A420 N414 N409 P439 DR
R544 VDD N414 100k
J_F144 VDD N414 P440 DR
R545 P440 N393 1k
R546 N393 VSS 4.8k
J_B142 N414 Scratch7_0 0 DR
J_A421 P437 CLK 0 DR
J_A422 P439 CLK 0 DR
J_A423 N397 Scratch7_0 P441 DR
R547 VDD N397 100k
J_F145 VDD N397 P442 DR
R548 P442 N387 1k
R549 N387 VSS 4.8k
J_B143 N397 N334 P443 DR
J_A424 N403 N387 0 DR
R550 VDD N403 50k
J_A425 VDD N403 P444 DR
R551 P444 N409 1k
R552 N409 VSS 4.5k
J_A426 P441 N331 0 DR
J_B144 P443 Bus0 0 DR
J_A427 P445 Scratch7_0 0 DR
J_A428 P446 ScratchPad_Word2 P445 DR
J_A429 7SPMux0 Scratch011 P446 DR
J_A430 N425 N429 P447 DR
R553 VDD N425 100k
J_F146 VDD N425 P448 DR
R554 P448 Scratch8_3 1k
R555 Scratch8_3 VSS 4.8k
J_B145 N425 N433 0 DR
J_A431 N449 N445 P449 DR
R556 VDD N449 100k
J_F147 VDD N449 P450 DR
R557 P450 N433 1k
R558 N433 VSS 4.8k
J_B146 N449 Scratch8_3 0 DR
J_A432 P447 CLK 0 DR
J_A433 P449 CLK 0 DR
J_A434 N437 Scratch8_3 P451 DR
R559 VDD N437 100k
J_F148 VDD N437 P452 DR
R560 P452 N429 1k
R561 N429 VSS 4.8k
J_B147 N437 N423 P453 DR
J_A435 N441 N429 0 DR
R562 VDD N441 50k
J_A436 VDD N441 P454 DR
R563 P454 N445 1k
R564 N445 VSS 4.5k
J_A437 P451 N421 0 DR
J_B148 P453 Bus3 0 DR
J_A438 P455 Scratch8_3 0 DR
J_A439 P456 ScratchPad_Word1 P455 DR
J_A440 15SPMux3 Scratch100 P456 DR
J_A441 N426 N430 P457 DR
R565 VDD N426 100k
J_F149 VDD N426 P458 DR
R566 P458 Scratch8_2 1k
R567 Scratch8_2 VSS 4.8k
J_B149 N426 N434 0 DR
J_A442 N450 N446 P459 DR
R568 VDD N450 100k
J_F150 VDD N450 P460 DR
R569 P460 N434 1k
R570 N434 VSS 4.8k
J_B150 N450 Scratch8_2 0 DR
J_A443 P457 CLK 0 DR
J_A444 P459 CLK 0 DR
J_A445 N438 Scratch8_2 P461 DR
R571 VDD N438 100k
J_F151 VDD N438 P462 DR
R572 P462 N430 1k
R573 N430 VSS 4.8k
J_B151 N438 N423 P463 DR
J_A446 N442 N430 0 DR
R574 VDD N442 50k
J_A447 VDD N442 P464 DR
R575 P464 N446 1k
R576 N446 VSS 4.5k
J_A448 P461 N421 0 DR
J_B152 P463 Bus2 0 DR
J_A449 P465 Scratch8_2 0 DR
J_A450 P466 ScratchPad_Word1 P465 DR
J_A451 15SPMux2 Scratch100 P466 DR
R577 VDD N416 100k
J_F152 VDD N416 P467 DR
R578 P467 N421 1k
R579 N421 VSS 4.8k
J_A452 N417 N421 0 DR
R580 VDD N417 50k
J_A453 VDD N417 P468 DR
R581 P468 N423 1k
R582 VSS N423 4.5k
J_A454 N416 Scratch_Load P469 DR
J_A455 P469 Scratch100 P470 DR
J_A456 P470 ScratchPad_Word1 0 DR
J_A457 N453 N457 P471 DR
R583 VDD N453 100k
J_F153 VDD N453 P472 DR
R584 P472 Scratch8_1 1k
R585 Scratch8_1 VSS 4.8k
J_B153 N453 N461 0 DR
J_A458 N477 N473 P473 DR
R586 VDD N477 100k
J_F154 VDD N477 P474 DR
R587 P474 N461 1k
R588 N461 VSS 4.8k
J_B154 N477 Scratch8_1 0 DR
J_A459 P471 CLK 0 DR
J_A460 P473 CLK 0 DR
J_A461 N465 Scratch8_1 P475 DR
R589 VDD N465 100k
J_F155 VDD N465 P476 DR
R590 P476 N457 1k
R591 N457 VSS 4.8k
J_B155 N465 N423 P477 DR
J_A462 N469 N457 0 DR
R592 VDD N469 50k
J_A463 VDD N469 P478 DR
R593 P478 N473 1k
R594 N473 VSS 4.5k
J_A464 P475 N421 0 DR
J_B156 P477 Bus1 0 DR
J_A465 P479 Scratch8_1 0 DR
J_A466 P480 ScratchPad_Word1 P479 DR
J_A467 15SPMux1 Scratch100 P480 DR
J_A468 N454 N458 P481 DR
R595 VDD N454 100k
J_F156 VDD N454 P482 DR
R596 P482 Scratch8_0 1k
R597 Scratch8_0 VSS 4.8k
J_B157 N454 N462 0 DR
J_A469 N478 N474 P483 DR
R598 VDD N478 100k
J_F157 VDD N478 P484 DR
R599 P484 N462 1k
R600 N462 VSS 4.8k
J_B158 N478 Scratch8_0 0 DR
J_A470 P481 CLK 0 DR
J_A471 P483 CLK 0 DR
J_A472 N466 Scratch8_0 P485 DR
R601 VDD N466 100k
J_F158 VDD N466 P486 DR
R602 P486 N458 1k
R603 N458 VSS 4.8k
J_B159 N466 N423 P487 DR
J_A473 N470 N458 0 DR
R604 VDD N470 50k
J_A474 VDD N470 P488 DR
R605 P488 N474 1k
R606 N474 VSS 4.5k
J_A475 P485 N421 0 DR
J_B160 P487 Bus0 0 DR
J_A476 P489 Scratch8_0 0 DR
J_A477 P490 ScratchPad_Word1 P489 DR
J_A478 15SPMux0 Scratch100 P490 DR
J_A479 N427 N431 P491 DR
R607 VDD N427 100k
J_F159 VDD N427 P492 DR
R608 P492 Scratch9_3 1k
R609 Scratch9_3 VSS 4.8k
J_B161 N427 N435 0 DR
J_A480 N451 N447 P493 DR
R610 VDD N451 100k
J_F160 VDD N451 P494 DR
R611 P494 N435 1k
R612 N435 VSS 4.8k
J_B162 N451 Scratch9_3 0 DR
J_A481 P491 CLK 0 DR
J_A482 P493 CLK 0 DR
J_A483 N439 Scratch9_3 P495 DR
R613 VDD N439 100k
J_F161 VDD N439 P496 DR
R614 P496 N431 1k
R615 N431 VSS 4.8k
J_B163 N439 N424 P497 DR
J_A484 N443 N431 0 DR
R616 VDD N443 50k
J_A485 VDD N443 P498 DR
R617 P498 N447 1k
R618 N447 VSS 4.5k
J_A486 P495 N422 0 DR
J_B164 P497 Bus3 0 DR
J_A487 P499 Scratch9_3 0 DR
J_A488 P500 ScratchPad_Word2 P499 DR
J_A489 15SPMux3 Scratch100 P500 DR
J_A490 N428 N432 P501 DR
R619 VDD N428 100k
J_F162 VDD N428 P502 DR
R620 P502 Scratch9_2 1k
R621 Scratch9_2 VSS 4.8k
J_B165 N428 N436 0 DR
J_A491 N452 N448 P503 DR
R622 VDD N452 100k
J_F163 VDD N452 P504 DR
R623 P504 N436 1k
R624 N436 VSS 4.8k
J_B166 N452 Scratch9_2 0 DR
J_A492 P501 CLK 0 DR
J_A493 P503 CLK 0 DR
J_A494 N440 Scratch9_2 P505 DR
R625 VDD N440 100k
J_F164 VDD N440 P506 DR
R626 P506 N432 1k
R627 N432 VSS 4.8k
J_B167 N440 N424 P507 DR
J_A495 N444 N432 0 DR
R628 VDD N444 50k
J_A496 VDD N444 P508 DR
R629 P508 N448 1k
R630 N448 VSS 4.5k
J_A497 P505 N422 0 DR
J_B168 P507 Bus2 0 DR
J_A498 P509 Scratch9_2 0 DR
J_A499 P510 ScratchPad_Word2 P509 DR
J_A500 15SPMux2 Scratch100 P510 DR
R631 VDD N418 100k
J_F165 VDD N418 P511 DR
R632 P511 N422 1k
R633 N422 VSS 4.8k
J_A501 N419 N422 0 DR
R634 VDD N419 50k
J_A502 VDD N419 P512 DR
R635 P512 N424 1k
R636 VSS N424 4.5k
J_A503 N418 Scratch_Load P513 DR
J_A504 P513 Scratch100 P514 DR
J_A505 P514 ScratchPad_Word2 0 DR
J_A506 N455 N459 P515 DR
R637 VDD N455 100k
J_F166 VDD N455 P516 DR
R638 P516 Scratch9_1 1k
R639 Scratch9_1 VSS 4.8k
J_B169 N455 N463 0 DR
J_A507 N479 N475 P517 DR
R640 VDD N479 100k
J_F167 VDD N479 P518 DR
R641 P518 N463 1k
R642 N463 VSS 4.8k
J_B170 N479 Scratch9_1 0 DR
J_A508 P515 CLK 0 DR
J_A509 P517 CLK 0 DR
J_A510 N467 Scratch9_1 P519 DR
R643 VDD N467 100k
J_F168 VDD N467 P520 DR
R644 P520 N459 1k
R645 N459 VSS 4.8k
J_B171 N467 N424 P521 DR
J_A511 N471 N459 0 DR
R646 VDD N471 50k
J_A512 VDD N471 P522 DR
R647 P522 N475 1k
R648 N475 VSS 4.5k
J_A513 P519 N422 0 DR
J_B172 P521 Bus1 0 DR
J_A514 P523 Scratch9_1 0 DR
J_A515 P524 ScratchPad_Word2 P523 DR
J_A516 15SPMux1 Scratch100 P524 DR
J_A517 N456 N460 P525 DR
R649 VDD N456 100k
J_F169 VDD N456 P526 DR
R650 P526 Scratch9_0 1k
R651 Scratch9_0 VSS 4.8k
J_B173 N456 N464 0 DR
J_A518 N480 N476 P527 DR
R652 VDD N480 100k
J_F170 VDD N480 P528 DR
R653 P528 N464 1k
R654 N464 VSS 4.8k
J_B174 N480 Scratch9_0 0 DR
J_A519 P525 CLK 0 DR
J_A520 P527 CLK 0 DR
J_A521 N468 Scratch9_0 P529 DR
R655 VDD N468 100k
J_F171 VDD N468 P530 DR
R656 P530 N460 1k
R657 N460 VSS 4.8k
J_B175 N468 N424 P531 DR
J_A522 N472 N460 0 DR
R658 VDD N472 50k
J_A523 VDD N472 P532 DR
R659 P532 N476 1k
R660 N476 VSS 4.5k
J_A524 P529 N422 0 DR
J_B176 P531 Bus0 0 DR
J_A525 P533 Scratch9_0 0 DR
J_A526 P534 ScratchPad_Word2 P533 DR
J_A527 15SPMux0 Scratch100 P534 DR
J_A528 N489 N493 P535 DR
R661 VDD N489 100k
J_F172 VDD N489 P536 DR
R662 P536 Scratch10_3 1k
R663 Scratch10_3 VSS 4.8k
J_B177 N489 N497 0 DR
J_A529 N513 N509 P537 DR
R664 VDD N513 100k
J_F173 VDD N513 P538 DR
R665 P538 N497 1k
R666 N497 VSS 4.8k
J_B178 N513 Scratch10_3 0 DR
J_A530 P535 CLK 0 DR
J_A531 P537 CLK 0 DR
J_A532 N501 Scratch10_3 P539 DR
R667 VDD N501 100k
J_F174 VDD N501 P540 DR
R668 P540 N493 1k
R669 N493 VSS 4.8k
J_B179 N501 N487 P541 DR
J_A533 N505 N493 0 DR
R670 VDD N505 50k
J_A534 VDD N505 P542 DR
R671 P542 N509 1k
R672 N509 VSS 4.5k
J_A535 P539 N485 0 DR
J_B180 P541 Bus3 0 DR
J_A536 P543 Scratch10_3 0 DR
J_A537 P544 ScratchPad_Word1 P543 DR
J_A538 15SPMux3 Scratch101 P544 DR
J_A539 N490 N494 P545 DR
R673 VDD N490 100k
J_F175 VDD N490 P546 DR
R674 P546 Scratch10_2 1k
R675 Scratch10_2 VSS 4.8k
J_B181 N490 N498 0 DR
J_A540 N514 N510 P547 DR
R676 VDD N514 100k
J_F176 VDD N514 P548 DR
R677 P548 N498 1k
R678 N498 VSS 4.8k
J_B182 N514 Scratch10_2 0 DR
J_A541 P545 CLK 0 DR
J_A542 P547 CLK 0 DR
J_A543 N502 Scratch10_2 P549 DR
R679 VDD N502 100k
J_F177 VDD N502 P550 DR
R680 P550 N494 1k
R681 N494 VSS 4.8k
J_B183 N502 N487 P551 DR
J_A544 N506 N494 0 DR
R682 VDD N506 50k
J_A545 VDD N506 P552 DR
R683 P552 N510 1k
R684 N510 VSS 4.5k
J_A546 P549 N485 0 DR
J_B184 P551 Bus2 0 DR
J_A547 P553 Scratch10_2 0 DR
J_A548 P554 ScratchPad_Word1 P553 DR
J_A549 15SPMux2 Scratch101 P554 DR
R685 VDD N481 100k
J_F178 VDD N481 P555 DR
R686 P555 N485 1k
R687 N485 VSS 4.8k
J_A550 N482 N485 0 DR
R688 VDD N482 50k
J_A551 VDD N482 P556 DR
R689 P556 N487 1k
R690 VSS N487 4.5k
J_A552 N481 Scratch_Load P557 DR
J_A553 P557 Scratch101 P558 DR
J_A554 P558 ScratchPad_Word1 0 DR
J_A555 N517 N521 P559 DR
R691 VDD N517 100k
J_F179 VDD N517 P560 DR
R692 P560 Scratch10_1 1k
R693 Scratch10_1 VSS 4.8k
J_B185 N517 N525 0 DR
J_A556 N541 N537 P561 DR
R694 VDD N541 100k
J_F180 VDD N541 P562 DR
R695 P562 N525 1k
R696 N525 VSS 4.8k
J_B186 N541 Scratch10_1 0 DR
J_A557 P559 CLK 0 DR
J_A558 P561 CLK 0 DR
J_A559 N529 Scratch10_1 P563 DR
R697 VDD N529 100k
J_F181 VDD N529 P564 DR
R698 P564 N521 1k
R699 N521 VSS 4.8k
J_B187 N529 N487 P565 DR
J_A560 N533 N521 0 DR
R700 VDD N533 50k
J_A561 VDD N533 P566 DR
R701 P566 N537 1k
R702 N537 VSS 4.5k
J_A562 P563 N485 0 DR
J_B188 P565 Bus1 0 DR
J_A563 P567 Scratch10_1 0 DR
J_A564 P568 ScratchPad_Word1 P567 DR
J_A565 15SPMux1 Scratch101 P568 DR
J_A566 N518 N522 P569 DR
R703 VDD N518 100k
J_F182 VDD N518 P570 DR
R704 P570 Scratch10_0 1k
R705 Scratch10_0 VSS 4.8k
J_B189 N518 N526 0 DR
J_A567 N542 N538 P571 DR
R706 VDD N542 100k
J_F183 VDD N542 P572 DR
R707 P572 N526 1k
R708 N526 VSS 4.8k
J_B190 N542 Scratch10_0 0 DR
J_A568 P569 CLK 0 DR
J_A569 P571 CLK 0 DR
J_A570 N530 Scratch10_0 P573 DR
R709 VDD N530 100k
J_F184 VDD N530 P574 DR
R710 P574 N522 1k
R711 N522 VSS 4.8k
J_B191 N530 N487 P575 DR
J_A571 N534 N522 0 DR
R712 VDD N534 50k
J_A572 VDD N534 P576 DR
R713 P576 N538 1k
R714 N538 VSS 4.5k
J_A573 P573 N485 0 DR
J_B192 P575 Bus0 0 DR
J_A574 P577 Scratch10_0 0 DR
J_A575 P578 ScratchPad_Word1 P577 DR
J_A576 15SPMux0 Scratch101 P578 DR
J_A577 N491 N495 P579 DR
R715 VDD N491 100k
J_F185 VDD N491 P580 DR
R716 P580 Scratch11_3 1k
R717 Scratch11_3 VSS 4.8k
J_B193 N491 N499 0 DR
J_A578 N515 N511 P581 DR
R718 VDD N515 100k
J_F186 VDD N515 P582 DR
R719 P582 N499 1k
R720 N499 VSS 4.8k
J_B194 N515 Scratch11_3 0 DR
J_A579 P579 CLK 0 DR
J_A580 P581 CLK 0 DR
J_A581 N503 Scratch11_3 P583 DR
R721 VDD N503 100k
J_F187 VDD N503 P584 DR
R722 P584 N495 1k
R723 N495 VSS 4.8k
J_B195 N503 N488 P585 DR
J_A582 N507 N495 0 DR
R724 VDD N507 50k
J_A583 VDD N507 P586 DR
R725 P586 N511 1k
R726 N511 VSS 4.5k
J_A584 P583 N486 0 DR
J_B196 P585 Bus3 0 DR
J_A585 P587 Scratch11_3 0 DR
J_A586 P588 ScratchPad_Word2 P587 DR
J_A587 15SPMux3 Scratch101 P588 DR
J_A588 N492 N496 P589 DR
R727 VDD N492 100k
J_F188 VDD N492 P590 DR
R728 P590 Scratch11_2 1k
R729 Scratch11_2 VSS 4.8k
J_B197 N492 N500 0 DR
J_A589 N516 N512 P591 DR
R730 VDD N516 100k
J_F189 VDD N516 P592 DR
R731 P592 N500 1k
R732 N500 VSS 4.8k
J_B198 N516 Scratch11_2 0 DR
J_A590 P589 CLK 0 DR
J_A591 P591 CLK 0 DR
J_A592 N504 Scratch11_2 P593 DR
R733 VDD N504 100k
J_F190 VDD N504 P594 DR
R734 P594 N496 1k
R735 N496 VSS 4.8k
J_B199 N504 N488 P595 DR
J_A593 N508 N496 0 DR
R736 VDD N508 50k
J_A594 VDD N508 P596 DR
R737 P596 N512 1k
R738 N512 VSS 4.5k
J_A595 P593 N486 0 DR
J_B200 P595 Bus2 0 DR
J_A596 P597 Scratch11_2 0 DR
J_A597 P598 ScratchPad_Word2 P597 DR
J_A598 15SPMux2 Scratch101 P598 DR
R739 VDD N483 100k
J_F191 VDD N483 P599 DR
R740 P599 N486 1k
R741 N486 VSS 4.8k
J_A599 N484 N486 0 DR
R742 VDD N484 50k
J_A600 VDD N484 P600 DR
R743 P600 N488 1k
R744 VSS N488 4.5k
J_A601 N483 Scratch_Load P601 DR
J_A602 P601 Scratch101 P602 DR
J_A603 P602 ScratchPad_Word2 0 DR
J_A604 N519 N523 P603 DR
R745 VDD N519 100k
J_F192 VDD N519 P604 DR
R746 P604 Scratch11_1 1k
R747 Scratch11_1 VSS 4.8k
J_B201 N519 N527 0 DR
J_A605 N543 N539 P605 DR
R748 VDD N543 100k
J_F193 VDD N543 P606 DR
R749 P606 N527 1k
R750 N527 VSS 4.8k
J_B202 N543 Scratch11_1 0 DR
J_A630 P603 CLK 0 DR
J_A631 P605 CLK 0 DR
J_A632 N531 Scratch11_1 P607 DR
R751 VDD N531 100k
J_F194 VDD N531 P608 DR
R752 P608 N523 1k
R753 N523 VSS 4.8k
J_B203 N531 N488 P609 DR
J_A633 N535 N523 0 DR
R754 VDD N535 50k
J_A634 VDD N535 P610 DR
R755 P610 N539 1k
R756 N539 VSS 4.5k
J_A635 P607 N486 0 DR
J_B204 P609 Bus1 0 DR
J_A636 P611 Scratch11_1 0 DR
J_A637 P612 ScratchPad_Word2 P611 DR
J_A644 15SPMux1 Scratch101 P612 DR
J_A645 N520 N524 P613 DR
R757 VDD N520 100k
J_F195 VDD N520 P614 DR
R758 P614 Scratch11_0 1k
R759 Scratch11_0 VSS 4.8k
J_B205 N520 N528 0 DR
J_A646 N544 N540 P615 DR
R760 VDD N544 100k
J_F196 VDD N544 P616 DR
R761 P616 N528 1k
R762 N528 VSS 4.8k
J_B206 N544 Scratch11_0 0 DR
J_A647 P613 CLK 0 DR
J_A648 P615 CLK 0 DR
J_A649 N532 Scratch11_0 P617 DR
R763 VDD N532 100k
J_F197 VDD N532 P618 DR
R764 P618 N524 1k
R765 N524 VSS 4.8k
J_B207 N532 N488 P619 DR
J_A650 N536 N524 0 DR
R766 VDD N536 50k
J_A651 VDD N536 P620 DR
R767 P620 N540 1k
R768 N540 VSS 4.5k
J_A652 P617 N486 0 DR
J_B208 P619 Bus0 0 DR
J_A653 P621 Scratch11_0 0 DR
J_A654 P622 ScratchPad_Word2 P621 DR
J_A655 15SPMux0 Scratch101 P622 DR
J_A656 N553 N557 P623 DR
R769 VDD N553 100k
J_F198 VDD N553 P624 DR
R770 P624 Scratch12_3 1k
R771 Scratch12_3 VSS 4.8k
J_B209 N553 N561 0 DR
J_A657 N577 N573 P625 DR
R772 VDD N577 100k
J_F199 VDD N577 P626 DR
R773 P626 N561 1k
R774 N561 VSS 4.8k
J_B210 N577 Scratch12_3 0 DR
J_A658 P623 CLK 0 DR
J_A659 P625 CLK 0 DR
J_A660 N565 Scratch12_3 P627 DR
R775 VDD N565 100k
J_F200 VDD N565 P628 DR
R776 P628 N557 1k
R777 N557 VSS 4.8k
J_B211 N565 N551 P629 DR
J_A661 N569 N557 0 DR
R778 VDD N569 50k
J_A662 VDD N569 P630 DR
R779 P630 N573 1k
R780 N573 VSS 4.5k
J_A663 P627 N549 0 DR
J_B212 P629 Bus3 0 DR
J_A664 P631 Scratch12_3 0 DR
J_A665 P632 ScratchPad_Word1 P631 DR
J_A666 15SPMux3 Scratch110 P632 DR
J_A667 N554 N558 P633 DR
R781 VDD N554 100k
J_F201 VDD N554 P634 DR
R782 P634 Scratch12_2 1k
R783 Scratch12_2 VSS 4.8k
J_B213 N554 N562 0 DR
J_A668 N578 N574 P635 DR
R784 VDD N578 100k
J_F202 VDD N578 P636 DR
R785 P636 N562 1k
R786 N562 VSS 4.8k
J_B214 N578 Scratch12_2 0 DR
J_A669 P633 CLK 0 DR
J_A670 P635 CLK 0 DR
J_A671 N566 Scratch12_2 P637 DR
R787 VDD N566 100k
J_F203 VDD N566 P638 DR
R788 P638 N558 1k
R789 N558 VSS 4.8k
J_B215 N566 N551 P639 DR
J_A672 N570 N558 0 DR
R790 VDD N570 50k
J_A673 VDD N570 P640 DR
R791 P640 N574 1k
R792 N574 VSS 4.5k
J_A674 P637 N549 0 DR
J_B216 P639 Bus2 0 DR
J_A675 P641 Scratch12_2 0 DR
J_A676 P642 ScratchPad_Word1 P641 DR
J_A677 15SPMux2 Scratch110 P642 DR
R793 VDD N545 100k
J_F204 VDD N545 P643 DR
R794 P643 N549 1k
R795 N549 VSS 4.8k
J_A678 N546 N549 0 DR
R796 VDD N546 50k
J_A679 VDD N546 P644 DR
R797 P644 N551 1k
R798 VSS N551 4.5k
J_A680 N545 Scratch_Load P645 DR
J_A681 P645 Scratch110 P646 DR
J_A682 P646 ScratchPad_Word1 0 DR
J_A683 N581 N585 P647 DR
R799 VDD N581 100k
J_F205 VDD N581 P648 DR
R800 P648 Scratch12_1 1k
R801 Scratch12_1 VSS 4.8k
J_B217 N581 N589 0 DR
J_A684 N605 N601 P649 DR
R802 VDD N605 100k
J_F206 VDD N605 P650 DR
R803 P650 N589 1k
R804 N589 VSS 4.8k
J_B218 N605 Scratch12_1 0 DR
J_A685 P647 CLK 0 DR
J_A686 P649 CLK 0 DR
J_A687 N593 Scratch12_1 P651 DR
R805 VDD N593 100k
J_F207 VDD N593 P652 DR
R806 P652 N585 1k
R807 N585 VSS 4.8k
J_B219 N593 N551 P653 DR
J_A688 N597 N585 0 DR
R808 VDD N597 50k
J_A689 VDD N597 P654 DR
R809 P654 N601 1k
R810 N601 VSS 4.5k
J_A690 P651 N549 0 DR
J_B220 P653 Bus1 0 DR
J_A691 P655 Scratch12_1 0 DR
J_A692 P656 ScratchPad_Word1 P655 DR
J_A693 15SPMux1 Scratch110 P656 DR
J_A694 N582 N586 P657 DR
R811 VDD N582 100k
J_F208 VDD N582 P658 DR
R812 P658 Scratch12_0 1k
R813 Scratch12_0 VSS 4.8k
J_B221 N582 N590 0 DR
J_A695 N606 N602 P659 DR
R814 VDD N606 100k
J_F218 VDD N606 P660 DR
R815 P660 N590 1k
R816 N590 VSS 4.8k
J_B222 N606 Scratch12_0 0 DR
J_A696 P657 CLK 0 DR
J_A697 P659 CLK 0 DR
J_A698 N594 Scratch12_0 P661 DR
R817 VDD N594 100k
J_F219 VDD N594 P662 DR
R818 P662 N586 1k
R819 N586 VSS 4.8k
J_B223 N594 N551 P663 DR
J_A699 N598 N586 0 DR
R820 VDD N598 50k
J_A700 VDD N598 P664 DR
R821 P664 N602 1k
R822 N602 VSS 4.5k
J_A701 P661 N549 0 DR
J_B224 P663 Bus0 0 DR
J_A702 P665 Scratch12_0 0 DR
J_A703 P666 ScratchPad_Word1 P665 DR
J_A704 15SPMux0 Scratch110 P666 DR
J_A705 N555 N559 P667 DR
R823 VDD N555 100k
J_F220 VDD N555 P668 DR
R824 P668 Scratch13_3 1k
R825 Scratch13_3 VSS 4.8k
J_B225 N555 N563 0 DR
J_A706 N579 N575 P669 DR
R826 VDD N579 100k
J_F224 VDD N579 P670 DR
R827 P670 N563 1k
R828 N563 VSS 4.8k
J_B226 N579 Scratch13_3 0 DR
J_A707 P667 CLK 0 DR
J_A708 P669 CLK 0 DR
J_A709 N567 Scratch13_3 P671 DR
R829 VDD N567 100k
J_F225 VDD N567 P672 DR
R830 P672 N559 1k
R831 N559 VSS 4.8k
J_B227 N567 N552 P673 DR
J_A710 N571 N559 0 DR
R832 VDD N571 50k
J_A711 VDD N571 P674 DR
R833 P674 N575 1k
R834 N575 VSS 4.5k
J_A712 P671 N550 0 DR
J_B228 P673 Bus3 0 DR
J_A713 P675 Scratch13_3 0 DR
J_A714 P676 ScratchPad_Word2 P675 DR
J_A715 15SPMux3 Scratch110 P676 DR
J_A716 N556 N560 P677 DR
R835 VDD N556 100k
J_F226 VDD N556 P678 DR
R836 P678 Scratch13_2 1k
R837 Scratch13_2 VSS 4.8k
J_B229 N556 N564 0 DR
J_A717 N580 N576 P679 DR
R838 VDD N580 100k
J_F227 VDD N580 P680 DR
R839 P680 N564 1k
R840 N564 VSS 4.8k
J_B230 N580 Scratch13_2 0 DR
J_A718 P677 CLK 0 DR
J_A719 P679 CLK 0 DR
J_A720 N568 Scratch13_2 P681 DR
R841 VDD N568 100k
J_F228 VDD N568 P682 DR
R842 P682 N560 1k
R843 N560 VSS 4.8k
J_B231 N568 N552 P683 DR
J_A721 N572 N560 0 DR
R844 VDD N572 50k
J_A722 VDD N572 P684 DR
R845 P684 N576 1k
R846 N576 VSS 4.5k
J_A723 P681 N550 0 DR
J_B232 P683 Bus2 0 DR
J_A724 P685 Scratch13_2 0 DR
J_A725 P686 ScratchPad_Word2 P685 DR
J_A726 15SPMux2 Scratch110 P686 DR
R847 VDD N547 100k
J_F229 VDD N547 P687 DR
R848 P687 N550 1k
R849 N550 VSS 4.8k
J_A727 N548 N550 0 DR
R886 VDD N548 50k
J_A728 VDD N548 P688 DR
R887 P688 N552 1k
R888 VSS N552 4.5k
J_A729 N547 Scratch_Load P689 DR
J_A730 P689 Scratch110 P690 DR
J_A731 P690 ScratchPad_Word2 0 DR
J_A732 N583 N587 P691 DR